# EasyEDA Pro project split-keyboard.eprj

# Schematic Schematic1
Board Name: Left; Create Date: 2025-08-14; Page Name: P1; Project Name: split-keyboard; Schematic Name: Schematic1; Update Date: 2025-09-05; Company: EasyEDA.com; Page Size: A4; Version: V1.0
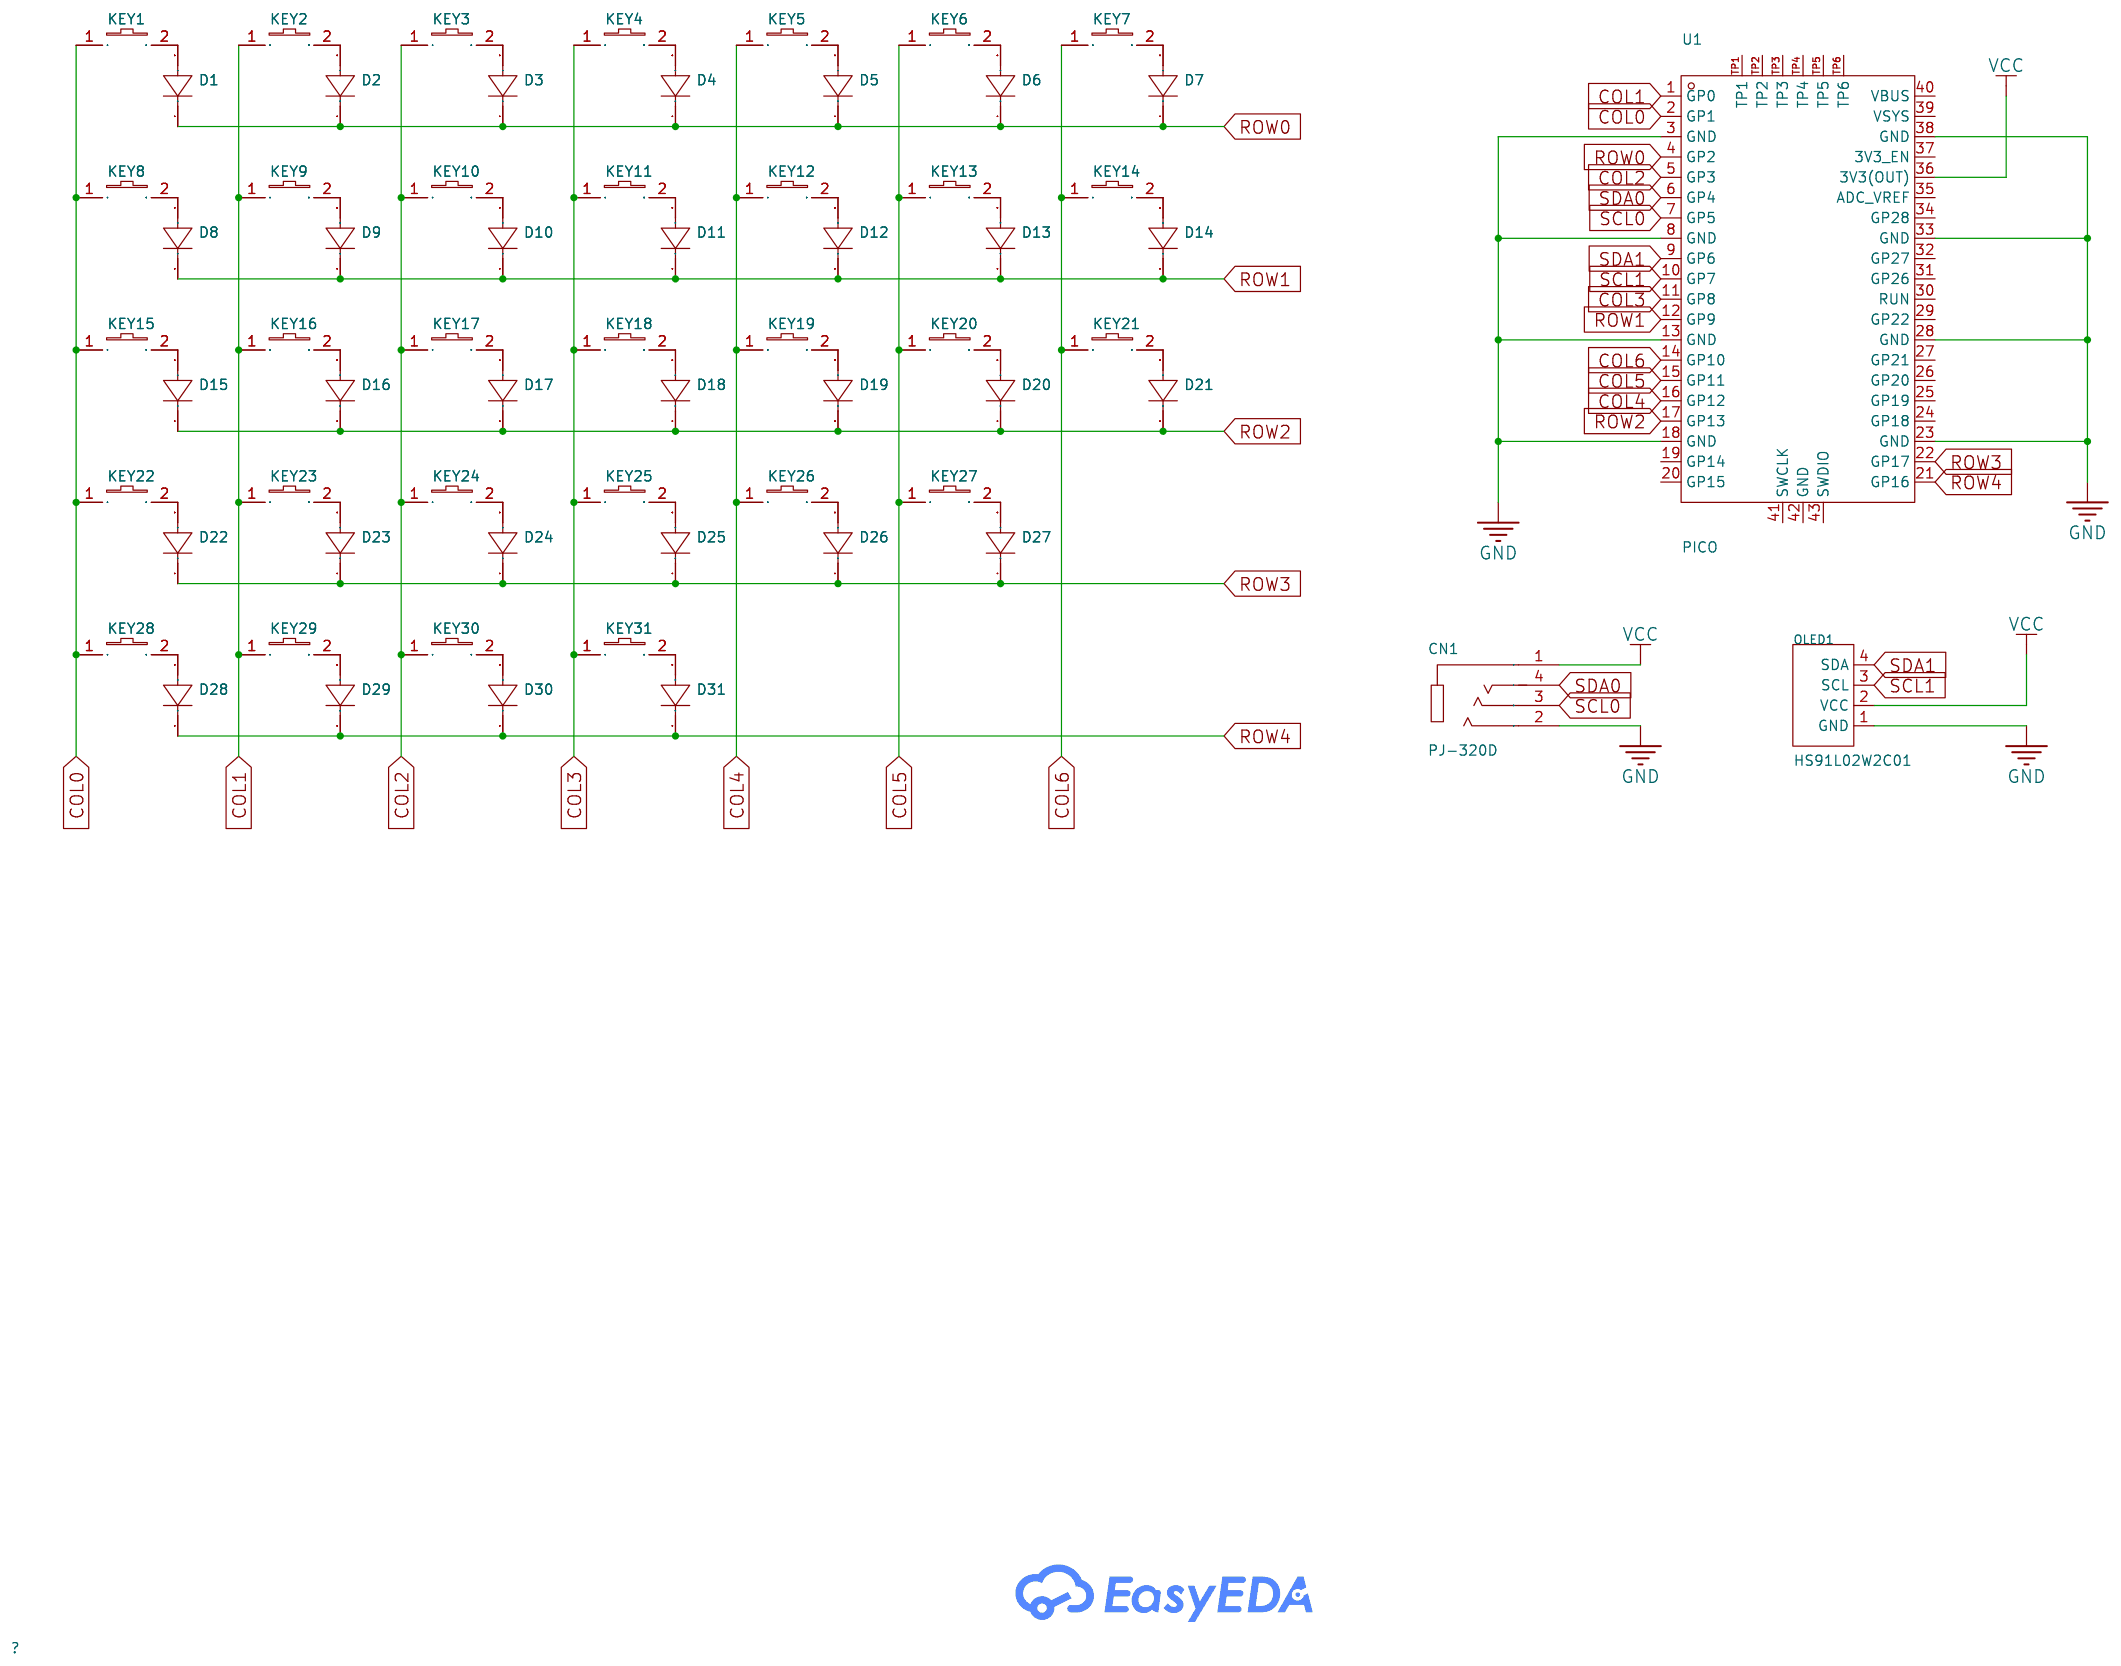
[diagram p0: schematic sheet]

## Parts
CN1  PJ-320D  [AUDIO-SMD_PJ-320D-1]
D1  -  [DO-41_BD2.4-L4.7-P8.70-D0.9-RD]
D2  -  [DO-41_BD2.4-L4.7-P8.70-D0.9-RD]
D3  -  [DO-41_BD2.4-L4.7-P8.70-D0.9-RD]
D4  -  [DO-41_BD2.4-L4.7-P8.70-D0.9-RD]
D5  -  [DO-41_BD2.4-L4.7-P8.70-D0.9-RD]
D6  -  [DO-41_BD2.4-L4.7-P8.70-D0.9-RD]
D7  -  [DO-41_BD2.4-L4.7-P8.70-D0.9-RD]
D8  -  [DO-41_BD2.4-L4.7-P8.70-D0.9-RD]
D9  -  [DO-41_BD2.4-L4.7-P8.70-D0.9-RD]
D10  -  [DO-41_BD2.4-L4.7-P8.70-D0.9-RD]
D11  -  [DO-41_BD2.4-L4.7-P8.70-D0.9-RD]
D12  -  [DO-41_BD2.4-L4.7-P8.70-D0.9-RD]
D13  -  [DO-41_BD2.4-L4.7-P8.70-D0.9-RD]
D14  -  [DO-41_BD2.4-L4.7-P8.70-D0.9-RD]
D15  -  [DO-41_BD2.4-L4.7-P8.70-D0.9-RD]
D16  -  [DO-41_BD2.4-L4.7-P8.70-D0.9-RD]
D17  -  [DO-41_BD2.4-L4.7-P8.70-D0.9-RD]
D18  -  [DO-41_BD2.4-L4.7-P8.70-D0.9-RD]
D19  -  [DO-41_BD2.4-L4.7-P8.70-D0.9-RD]
D20  -  [DO-41_BD2.4-L4.7-P8.70-D0.9-RD]
D21  -  [DO-41_BD2.4-L4.7-P8.70-D0.9-RD]
D22  -  [DO-41_BD2.4-L4.7-P8.70-D0.9-RD]
D23  -  [DO-41_BD2.4-L4.7-P8.70-D0.9-RD]
D24  -  [DO-41_BD2.4-L4.7-P8.70-D0.9-RD]
D25  -  [DO-41_BD2.4-L4.7-P8.70-D0.9-RD]
D26  -  [DO-41_BD2.4-L4.7-P8.70-D0.9-RD]
D27  -  [DO-41_BD2.4-L4.7-P8.70-D0.9-RD]
D28  -  [DO-41_BD2.4-L4.7-P8.70-D0.9-RD]
D29  -  [DO-41_BD2.4-L4.7-P8.70-D0.9-RD]
D30  -  [DO-41_BD2.4-L4.7-P8.70-D0.9-RD]
D31  -  [DO-41_BD2.4-L4.7-P8.70-D0.9-RD]
KEY1  28115182DM  [MX_PCB_1.00u]
KEY2  28115182DM  [MX_PCB_1.00u]
KEY3  28115182DM  [MX_PCB_1.00u]
KEY4  28115182DM  [MX_PCB_1.00u]
KEY5  28115182DM  [MX_PCB_1.00u]
KEY6  28115182DM  [MX_PCB_1.00u]
KEY7  28115182DM  [MX_PCB_1.00u]
KEY8  28115182DM  [MX_PCB_1.00u]
KEY9  28115182DM  [MX_PCB_1.00u]
KEY10  28115182DM  [MX_PCB_1.00u]
KEY11  28115182DM  [MX_PCB_1.00u]
KEY12  28115182DM  [MX_PCB_1.00u]
KEY13  28115182DM  [MX_PCB_1.00u]
KEY14  28115182DM  [MX_PCB_1.00u]
KEY15  28115182DM  [MX_PCB_1.00u]
KEY16  28115182DM  [MX_PCB_1.00u]
KEY17  28115182DM  [MX_PCB_1.00u]
KEY18  28115182DM  [MX_PCB_1.00u]
KEY19  28115182DM  [MX_PCB_1.00u]
KEY20  28115182DM  [MX_PCB_1.00u]
KEY21  28115182DM  [MX_PCB_1.00u]
KEY22  28115182DM  [MX_PCB_1.00u]
KEY23  28115182DM  [MX_PCB_1.00u]
KEY24  28115182DM  [MX_PCB_1.00u]
KEY25  28115182DM  [MX_PCB_1.00u]
KEY26  28115182DM  [MX_PCB_1.00u]
KEY27  28115182DM  [MX_PCB_1.00u]
KEY28  28115182DM  [MX_PCB_1.00u]
KEY29  28115182DM  [MX_PCB_1.00u]
KEY30  28115182DM  [MX_PCB_1.00u]
KEY31  28115182DM  [MX_PCB_1.00u]
OLED1  HS91L02W2C01  [OLED-TH_L38.0-W12.0_HS91L02W2C01]
U1  PICO  [Raspberry_Pi_Pico]

## Library data of the parts
CN1 = PJ-320D_C431535: Connector Type:3.5mm Headphone Jack Current Rating (Max):500mA Voltage Rating (Max):50V Contact Material:Copper Contact Plating:Silver Operating Temperature Range:-30℃~+70℃ Operating Temperature Range:-30℃~+70℃; LCSC Part Name: 3.5mm耳机座; Supplier Part: C431535; Manufacturer: SHOU HAN(首韩); Supplier Footprint: SMD; Datasheet: https://atta.szlcsc.com/upload/public/pdf/source/20190925/C431535_8B274506621F6117FB020BF07A197848.pdf; Supplier: LCSC; Connector Type: 3.5mm Headphone Jack; Current Rating (Max): 500mA; Voltage Rating (Max): 50V; Contact Material: Copper; Contact Plating: Silver; Operating Temperature Range: -30℃~+70℃
D1-D31 = 1N4007: Supplier Footprint: DO-41
KEY1-KEY31 = 28115182DM: Axis Type:水晶轴 Number of Pins:2 Life:5000万次 Operation Force:60gf Conduction Travel:- Voltage Rating:- Operating Temperature:-10℃~+70℃ Operating Temperature:-10℃~+70℃; Supplier Part: C47121945; Manufacturer: SAMZO(三佐); Supplier Footprint: 插件; JLCPCB Part Class: Extended Part; Datasheet: https://atta.szlcsc.com/upload/public/pdf/source/20250402/8399631E7C857A557AEE3DBE24222DC8.pdf; Supplier: LCSC; Axis Type: 水晶轴; Number of Pins: 2; Life: 5000万次; Operation Force: 60gf; Operating Temperature: -10℃~+70℃
OLED1 = HS91L02W2C01: LCSC Part Name: 0.91寸OLED显示屏白光IIC; Supplier Part: C5248081; Manufacturer: HS(汉昇); JLCPCB Part Class: Extended Part; Datasheet: https://atta.szlcsc.com/upload/public/pdf/source/20230727/C3E43C8E3DDA847F5681FEE7D95C153D.pdf; Supplier: LCSC; Main Control Chip: SSD1306; Interface Type: I2C; Size: 0.91; Pixel Resolution: 128x32; Operating Temperature: -40℃~+70℃
U1 = PICO: Supplier Part: C7203002; Manufacturer: Raspberry Pi(树莓派); Datasheet: https://atta.szlcsc.com/upload/public/pdf/source/20230906/086376002DDC9866828648BC93E51F8B.pdf; Supplier: LCSC

## Nets
GND: CN1.2 OLED1.1(GND) U1.3(GND) U1.8(GND) U1.13(GND) U1.18(GND) U1.23(GND) U1.28(GND) U1.33(GND) U1.38(GND)
VCC: CN1.1 OLED1.2(VCC) U1.36(3V3(OUT))
COL0: KEY1.1 KEY8.1 KEY15.1 KEY22.1 KEY28.1 U1.2(GP1)
COL1: KEY2.1 KEY9.1 KEY16.1 KEY23.1 KEY29.1 U1.1(GP0)
COL2: KEY3.1 KEY10.1 KEY17.1 KEY24.1 KEY30.1 U1.5(GP3)
COL3: KEY4.1 KEY11.1 KEY18.1 KEY25.1 KEY31.1 U1.11(GP8)
COL4: KEY5.1 KEY12.1 KEY19.1 KEY26.1 U1.16(GP12)
COL5: KEY6.1 KEY13.1 KEY20.1 KEY27.1 U1.15(GP11)
COL6: KEY7.1 KEY14.1 KEY21.1 U1.14(GP10)
ROW0: D1.1(K) D2.1(K) D3.1(K) D4.1(K) D5.1(K) D6.1(K) D7.1(K) U1.4(GP2)
ROW1: D8.1(K) D9.1(K) D10.1(K) D11.1(K) D12.1(K) D13.1(K) D14.1(K) U1.12(GP9)
ROW2: D15.1(K) D16.1(K) D17.1(K) D18.1(K) D19.1(K) D20.1(K) D21.1(K) U1.17(GP13)
ROW3: D22.1(K) D23.1(K) D24.1(K) D25.1(K) D26.1(K) D27.1(K) U1.22(GP17)
ROW4: D28.1(K) D29.1(K) D30.1(K) D31.1(K) U1.21(GP16)
SCL0: CN1.3 U1.7(GP5)
SCL1: OLED1.3(SCL) U1.10(GP7)
SDA0: CN1.4 U1.6(GP4)
SDA1: OLED1.4(SDA) U1.9(GP6)
$1N158: D1.2(A) KEY1.2
$1N243: D2.2(A) KEY2.2
$1N305: D3.2(A) KEY3.2
$1N549: D4.2(A) KEY4.2
$1N551: D5.2(A) KEY5.2
$1N553: D6.2(A) KEY6.2
$1N987: D7.2(A) KEY7.2
$1N1409: D8.2(A) KEY8.2
$1N1411: D9.2(A) KEY9.2
$1N1413: D10.2(A) KEY10.2
$1N1415: D11.2(A) KEY11.2
$1N1417: D12.2(A) KEY12.2
$1N1419: D13.2(A) KEY13.2
$1N1421: D14.2(A) KEY14.2
$1N1843: D15.2(A) KEY15.2
$1N1845: D16.2(A) KEY16.2
$1N1847: D17.2(A) KEY17.2
$1N1849: D18.2(A) KEY18.2
$1N1851: D19.2(A) KEY19.2
$1N1853: D20.2(A) KEY20.2
$1N1855: D21.2(A) KEY21.2
$1N2217: D22.2(A) KEY22.2
$1N2219: D23.2(A) KEY23.2
$1N2221: D24.2(A) KEY24.2
$1N2223: D25.2(A) KEY25.2
$1N2225: D26.2(A) KEY26.2
$1N2227: D27.2(A) KEY27.2
$1N2529: D28.2(A) KEY28.2
$1N2531: D29.2(A) KEY29.2
$1N4626: D30.2(A) KEY30.2
$1N4628: D31.2(A) KEY31.2

Not connected (* = marked no-connect by the designer): U1 19(GP14) 20(GP15) 24(GP18) 25(GP19) 26(GP20) 27(GP21) 29(GP22) 30(RUN) 31(GP26) 32(GP27) 34(GP28) 35(ADC_VREF) 37(3V3_EN) 39(VSYS) 40(VBUS) 41(SWCLK) 42(GND) 43(SWDIO) TP1 TP2 TP3 TP4 TP5 TP6

# Schematic Schematic2
Board Name: Right; Create Date: 2025-09-15; Page Name: P1; Project Name: split-keyboard; Schematic Name: Schematic2; Update Date: 2025-09-16; Company: EasyEDA.com; Page Size: A4; Version: V1.0
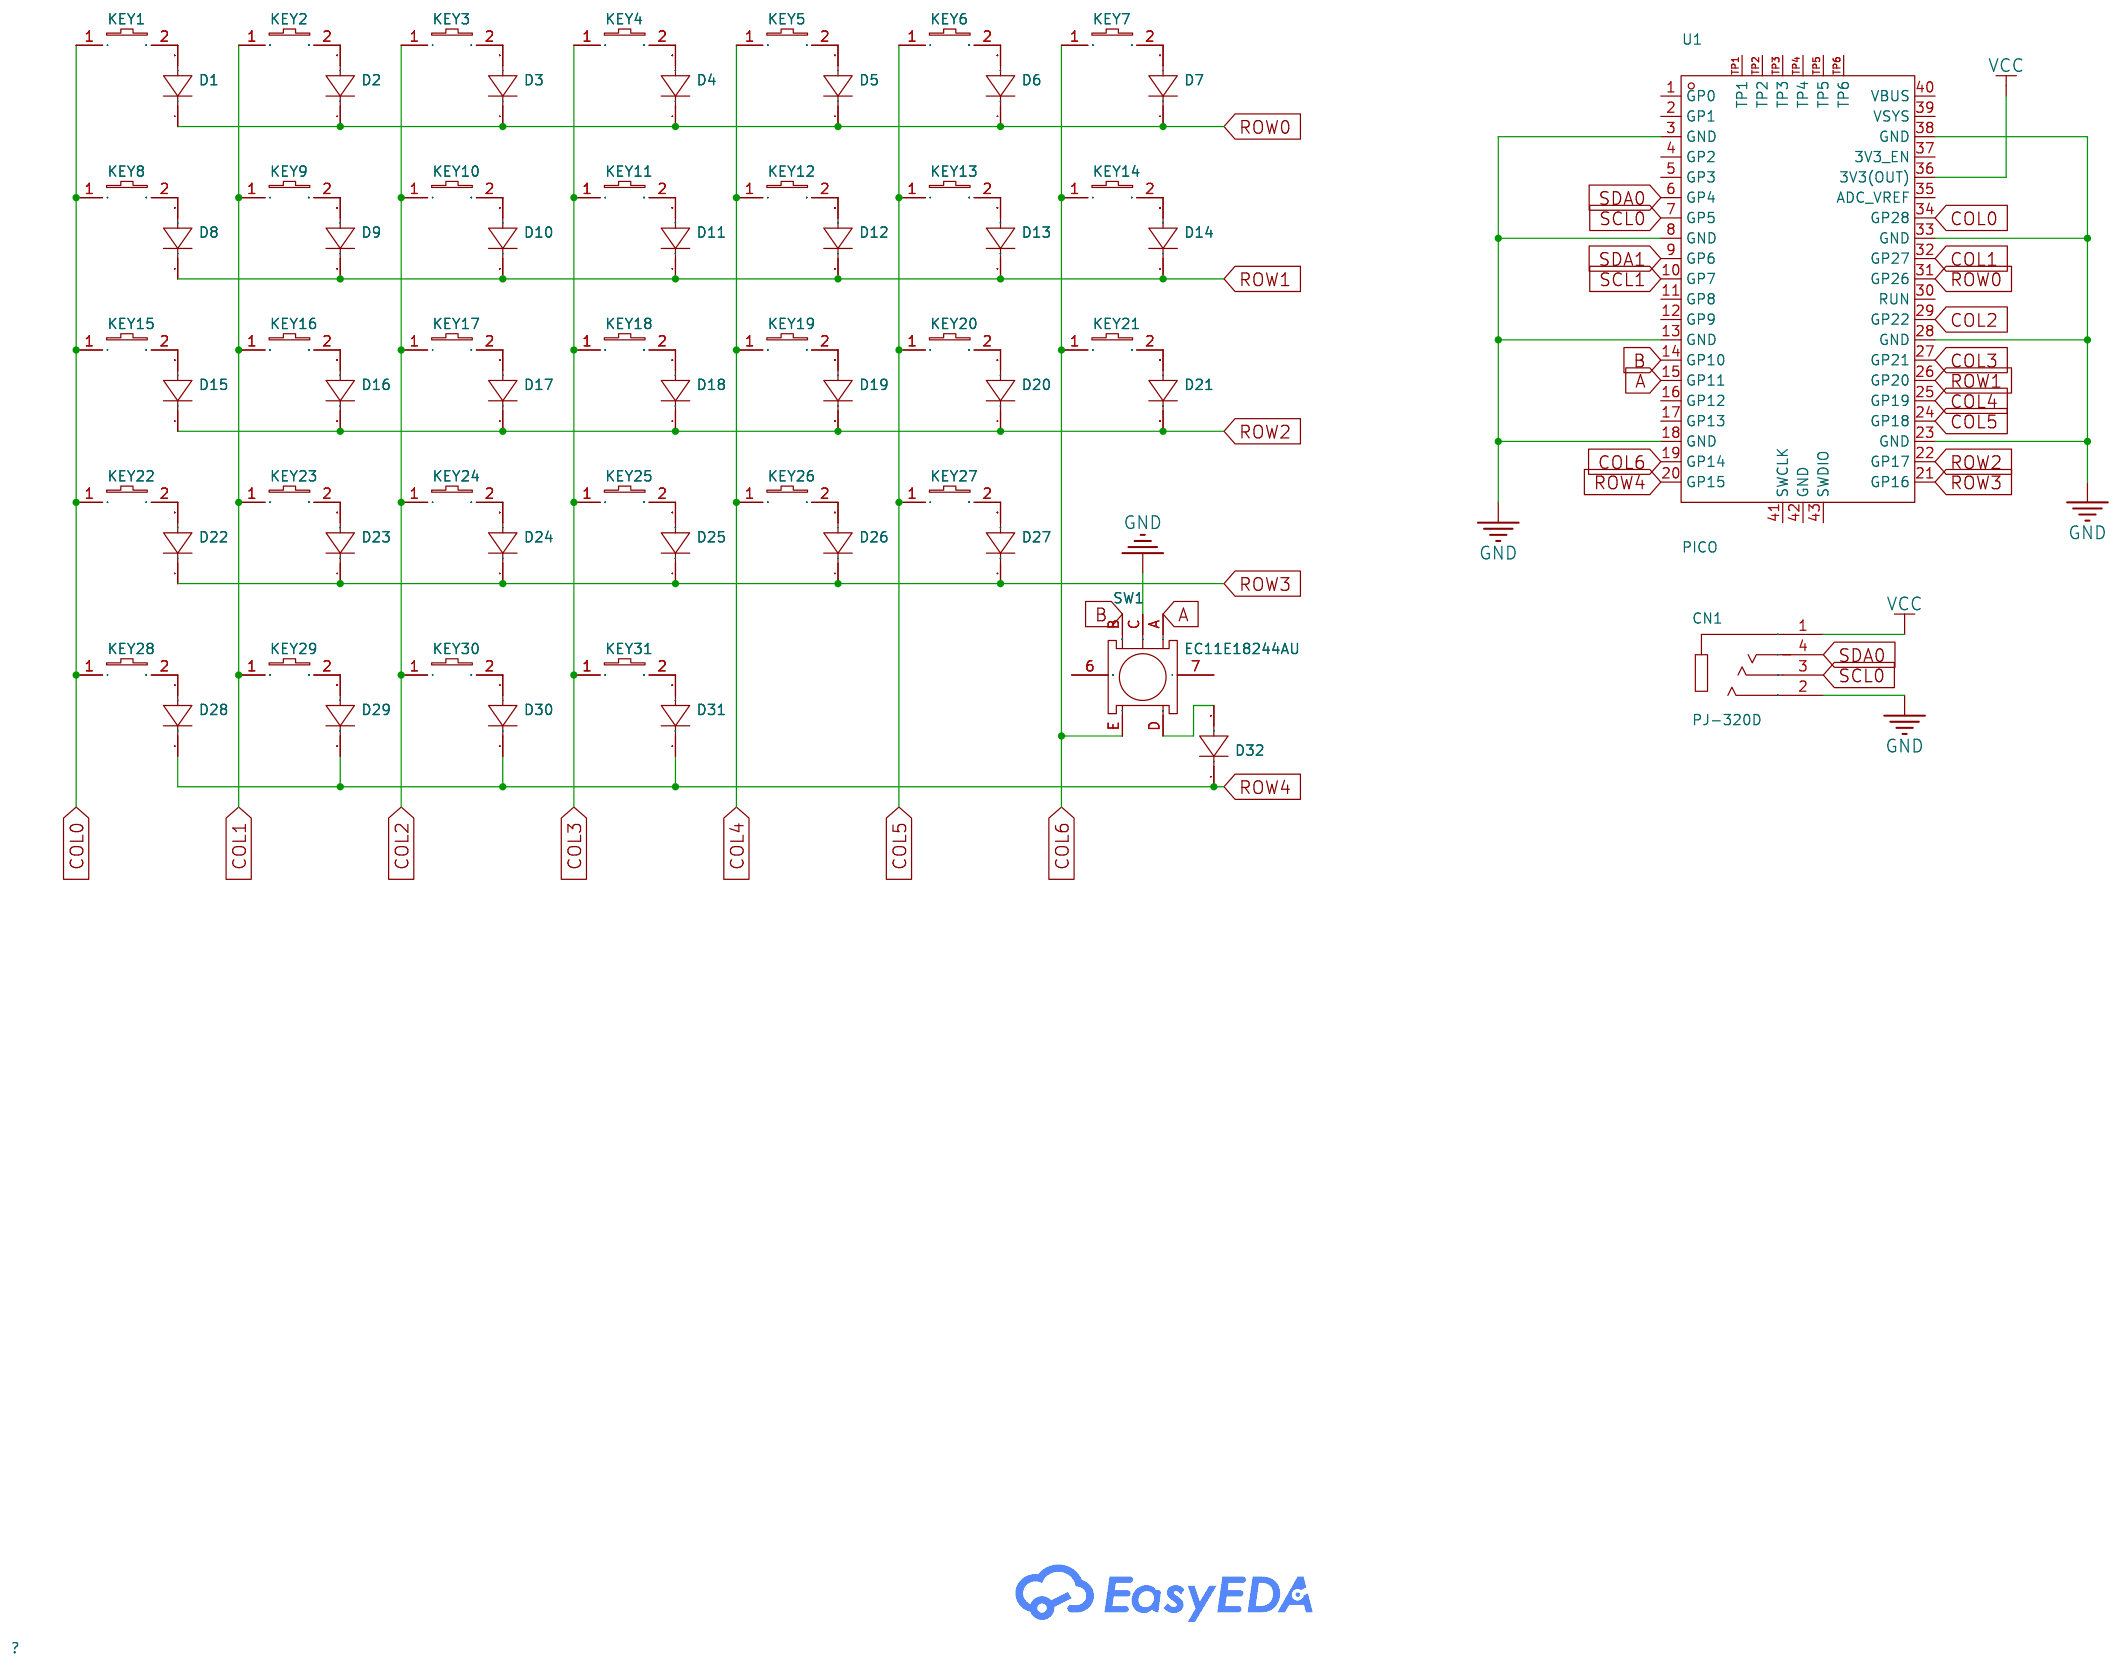
[diagram p1: schematic sheet]

## Parts
CN1  PJ-320D  [AUDIO-SMD_PJ-320D-1]
D1  -  [DO-41_BD2.4-L4.7-P8.70-D0.9-RD]
D2  -  [DO-41_BD2.4-L4.7-P8.70-D0.9-RD]
D3  -  [DO-41_BD2.4-L4.7-P8.70-D0.9-RD]
D4  -  [DO-41_BD2.4-L4.7-P8.70-D0.9-RD]
D5  -  [DO-41_BD2.4-L4.7-P8.70-D0.9-RD]
D6  -  [DO-41_BD2.4-L4.7-P8.70-D0.9-RD]
D7  -  [DO-41_BD2.4-L4.7-P8.70-D0.9-RD]
D8  -  [DO-41_BD2.4-L4.7-P8.70-D0.9-RD]
D9  -  [DO-41_BD2.4-L4.7-P8.70-D0.9-RD]
D10  -  [DO-41_BD2.4-L4.7-P8.70-D0.9-RD]
D11  -  [DO-41_BD2.4-L4.7-P8.70-D0.9-RD]
D12  -  [DO-41_BD2.4-L4.7-P8.70-D0.9-RD]
D13  -  [DO-41_BD2.4-L4.7-P8.70-D0.9-RD]
D14  -  [DO-41_BD2.4-L4.7-P8.70-D0.9-RD]
D15  -  [DO-41_BD2.4-L4.7-P8.70-D0.9-RD]
D16  -  [DO-41_BD2.4-L4.7-P8.70-D0.9-RD]
D17  -  [DO-41_BD2.4-L4.7-P8.70-D0.9-RD]
D18  -  [DO-41_BD2.4-L4.7-P8.70-D0.9-RD]
D19  -  [DO-41_BD2.4-L4.7-P8.70-D0.9-RD]
D20  -  [DO-41_BD2.4-L4.7-P8.70-D0.9-RD]
D21  -  [DO-41_BD2.4-L4.7-P8.70-D0.9-RD]
D22  -  [DO-41_BD2.4-L4.7-P8.70-D0.9-RD]
D23  -  [DO-41_BD2.4-L4.7-P8.70-D0.9-RD]
D24  -  [DO-41_BD2.4-L4.7-P8.70-D0.9-RD]
D25  -  [DO-41_BD2.4-L4.7-P8.70-D0.9-RD]
D26  -  [DO-41_BD2.4-L4.7-P8.70-D0.9-RD]
D27  -  [DO-41_BD2.4-L4.7-P8.70-D0.9-RD]
D28  -  [DO-41_BD2.4-L4.7-P8.70-D0.9-RD]
D29  -  [DO-41_BD2.4-L4.7-P8.70-D0.9-RD]
D30  -  [DO-41_BD2.4-L4.7-P8.70-D0.9-RD]
D31  -  [DO-41_BD2.4-L4.7-P8.70-D0.9-RD]
D32  -  [DO-41_BD2.4-L4.7-P8.70-D0.9-RD]
KEY1  28115182DM  [MX_PCB_1.00u]
KEY2  28115182DM  [MX_PCB_1.00u]
KEY3  28115182DM  [MX_PCB_1.00u]
KEY4  28115182DM  [MX_PCB_1.00u]
KEY5  28115182DM  [MX_PCB_1.00u]
KEY6  28115182DM  [MX_PCB_1.00u]
KEY7  28115182DM  [MX_PCB_1.00u]
KEY8  28115182DM  [MX_PCB_1.00u]
KEY9  28115182DM  [MX_PCB_1.00u]
KEY10  28115182DM  [MX_PCB_1.00u]
KEY11  28115182DM  [MX_PCB_1.00u]
KEY12  28115182DM  [MX_PCB_1.00u]
KEY13  28115182DM  [MX_PCB_1.00u]
KEY14  28115182DM  [MX_PCB_1.00u]
KEY15  28115182DM  [MX_PCB_1.00u]
KEY16  28115182DM  [MX_PCB_1.00u]
KEY17  28115182DM  [MX_PCB_1.00u]
KEY18  28115182DM  [MX_PCB_1.00u]
KEY19  28115182DM  [MX_PCB_1.00u]
KEY20  28115182DM  [MX_PCB_1.00u]
KEY21  28115182DM  [MX_PCB_1.00u]
KEY22  28115182DM  [MX_PCB_1.00u]
KEY23  28115182DM  [MX_PCB_1.00u]
KEY24  28115182DM  [MX_PCB_1.00u]
KEY25  28115182DM  [MX_PCB_1.00u]
KEY26  28115182DM  [MX_PCB_1.00u]
KEY27  28115182DM  [MX_PCB_1.00u]
KEY28  28115182DM  [MX_PCB_1.00u]
KEY29  28115182DM  [MX_PCB_1.00u]
KEY30  28115182DM  [MX_PCB_1.00u]
KEY31  28115182DM  [MX_PCB_1.00u]
SW1  EC11E18244AU  [SW-TH_EC11XXXXXXXX]
U1  PICO  [Raspberry_Pi_Pico]

## Library data of the parts
CN1 = PJ-320D_C431535: Connector Type:3.5mm Headphone Jack Current Rating (Max):500mA Voltage Rating (Max):50V Contact Material:Copper Contact Plating:Silver Operating Temperature Range:-30℃~+70℃ Operating Temperature Range:-30℃~+70℃; LCSC Part Name: 3.5mm耳机座; Supplier Part: C431535; Manufacturer: SHOU HAN(首韩); Supplier Footprint: SMD; Datasheet: https://atta.szlcsc.com/upload/public/pdf/source/20190925/C431535_8B274506621F6117FB020BF07A197848.pdf; Supplier: LCSC; Connector Type: 3.5mm Headphone Jack; Current Rating (Max): 500mA; Voltage Rating (Max): 50V; Contact Material: Copper; Contact Plating: Silver; Operating Temperature Range: -30℃~+70℃
D1-D32 = 1N4007: Supplier Footprint: DO-41
KEY1-KEY31 = 28115182DM: Axis Type:水晶轴 Number of Pins:2 Life:5000万次 Operation Force:60gf Conduction Travel:- Voltage Rating:- Operating Temperature:-10℃~+70℃ Operating Temperature:-10℃~+70℃; Supplier Part: C47121945; Manufacturer: SAMZO(三佐); Supplier Footprint: 插件; JLCPCB Part Class: Extended Part; Datasheet: https://atta.szlcsc.com/upload/public/pdf/source/20250402/8399631E7C857A557AEE3DBE24222DC8.pdf; Supplier: LCSC; Axis Type: 水晶轴; Number of Pins: 2; Life: 5000万次; Operation Force: 60gf; Operating Temperature: -10℃~+70℃
SW1 = EC11E18244AU: Supplier Part: C202365; Manufacturer: ALPSALPINE(阿尔卑斯阿尔派); Supplier Footprint: 插件; Datasheet: https://atta.szlcsc.com/upload/public/pdf/source/20180403/C202365_70FA927E879F562641EADC151E1E414A.pdf; Supplier: LCSC
U1 = PICO: Supplier Part: C7203002; Manufacturer: Raspberry Pi(树莓派); Datasheet: https://atta.szlcsc.com/upload/public/pdf/source/20230906/086376002DDC9866828648BC93E51F8B.pdf; Supplier: LCSC

## Nets
GND: CN1.2 SW1.C U1.3(GND) U1.8(GND) U1.13(GND) U1.18(GND) U1.23(GND) U1.28(GND) U1.33(GND) U1.38(GND)
VCC: CN1.1 U1.36(3V3(OUT))
A: SW1.A U1.15(GP11)
B: SW1.B U1.14(GP10)
COL0: KEY1.1 KEY8.1 KEY15.1 KEY22.1 KEY28.1 U1.34(GP28)
COL1: KEY2.1 KEY9.1 KEY16.1 KEY23.1 KEY29.1 U1.32(GP27)
COL2: KEY3.1 KEY10.1 KEY17.1 KEY24.1 KEY30.1 U1.29(GP22)
COL3: KEY4.1 KEY11.1 KEY18.1 KEY25.1 KEY31.1 U1.27(GP21)
COL4: KEY5.1 KEY12.1 KEY19.1 KEY26.1 U1.25(GP19)
COL5: KEY6.1 KEY13.1 KEY20.1 KEY27.1 U1.24(GP18)
COL6: KEY7.1 KEY14.1 KEY21.1 SW1.E U1.19(GP14)
ROW0: D1.1(K) D2.1(K) D3.1(K) D4.1(K) D5.1(K) D6.1(K) D7.1(K) U1.31(GP26)
ROW1: D8.1(K) D9.1(K) D10.1(K) D11.1(K) D12.1(K) D13.1(K) D14.1(K) U1.26(GP20)
ROW2: D15.1(K) D16.1(K) D17.1(K) D18.1(K) D19.1(K) D20.1(K) D21.1(K) U1.22(GP17)
ROW3: D22.1(K) D23.1(K) D24.1(K) D25.1(K) D26.1(K) D27.1(K) U1.21(GP16)
ROW4: D28.1(K) D29.1(K) D30.1(K) D31.1(K) D32.1(K) U1.20(GP15)
SCL0: CN1.3 U1.7(GP5)
SCL1: U1.10(GP7)
SDA0: CN1.4 U1.6(GP4)
SDA1: U1.9(GP6)
$1N158: D1.2(A) KEY1.2
$1N243: D2.2(A) KEY2.2
$1N305: D3.2(A) KEY3.2
$1N549: D4.2(A) KEY4.2
$1N551: D5.2(A) KEY5.2
$1N553: D6.2(A) KEY6.2
$1N987: D7.2(A) KEY7.2
$1N1409: D8.2(A) KEY8.2
$1N1411: D9.2(A) KEY9.2
$1N1413: D10.2(A) KEY10.2
$1N1415: D11.2(A) KEY11.2
$1N1417: D12.2(A) KEY12.2
$1N1419: D13.2(A) KEY13.2
$1N1421: D14.2(A) KEY14.2
$1N1843: D15.2(A) KEY15.2
$1N1845: D16.2(A) KEY16.2
$1N1847: D17.2(A) KEY17.2
$1N1849: D18.2(A) KEY18.2
$1N1851: D19.2(A) KEY19.2
$1N1853: D20.2(A) KEY20.2
$1N1855: D21.2(A) KEY21.2
$1N2217: D22.2(A) KEY22.2
$1N2219: D23.2(A) KEY23.2
$1N2221: D24.2(A) KEY24.2
$1N2223: D25.2(A) KEY25.2
$1N2225: D26.2(A) KEY26.2
$1N2227: D27.2(A) KEY27.2
$1N2529: D28.2(A) KEY28.2
$1N2531: D29.2(A) KEY29.2
$1N4626: D30.2(A) KEY30.2
$1N4628: D31.2(A) KEY31.2
$1N26639: D32.2(A) SW1.D

Not connected (* = marked no-connect by the designer): SW1 6 7; U1 1(GP0) 2(GP1) 4(GP2) 5(GP3) 11(GP8) 12(GP9) 16(GP12) 17(GP13) 30(RUN) 35(ADC_VREF) 37(3V3_EN) 39(VSYS) 40(VBUS) 41(SWCLK) 42(GND) 43(SWDIO) TP1 TP2 TP3 TP4 TP5 TP6

# Board PCB2
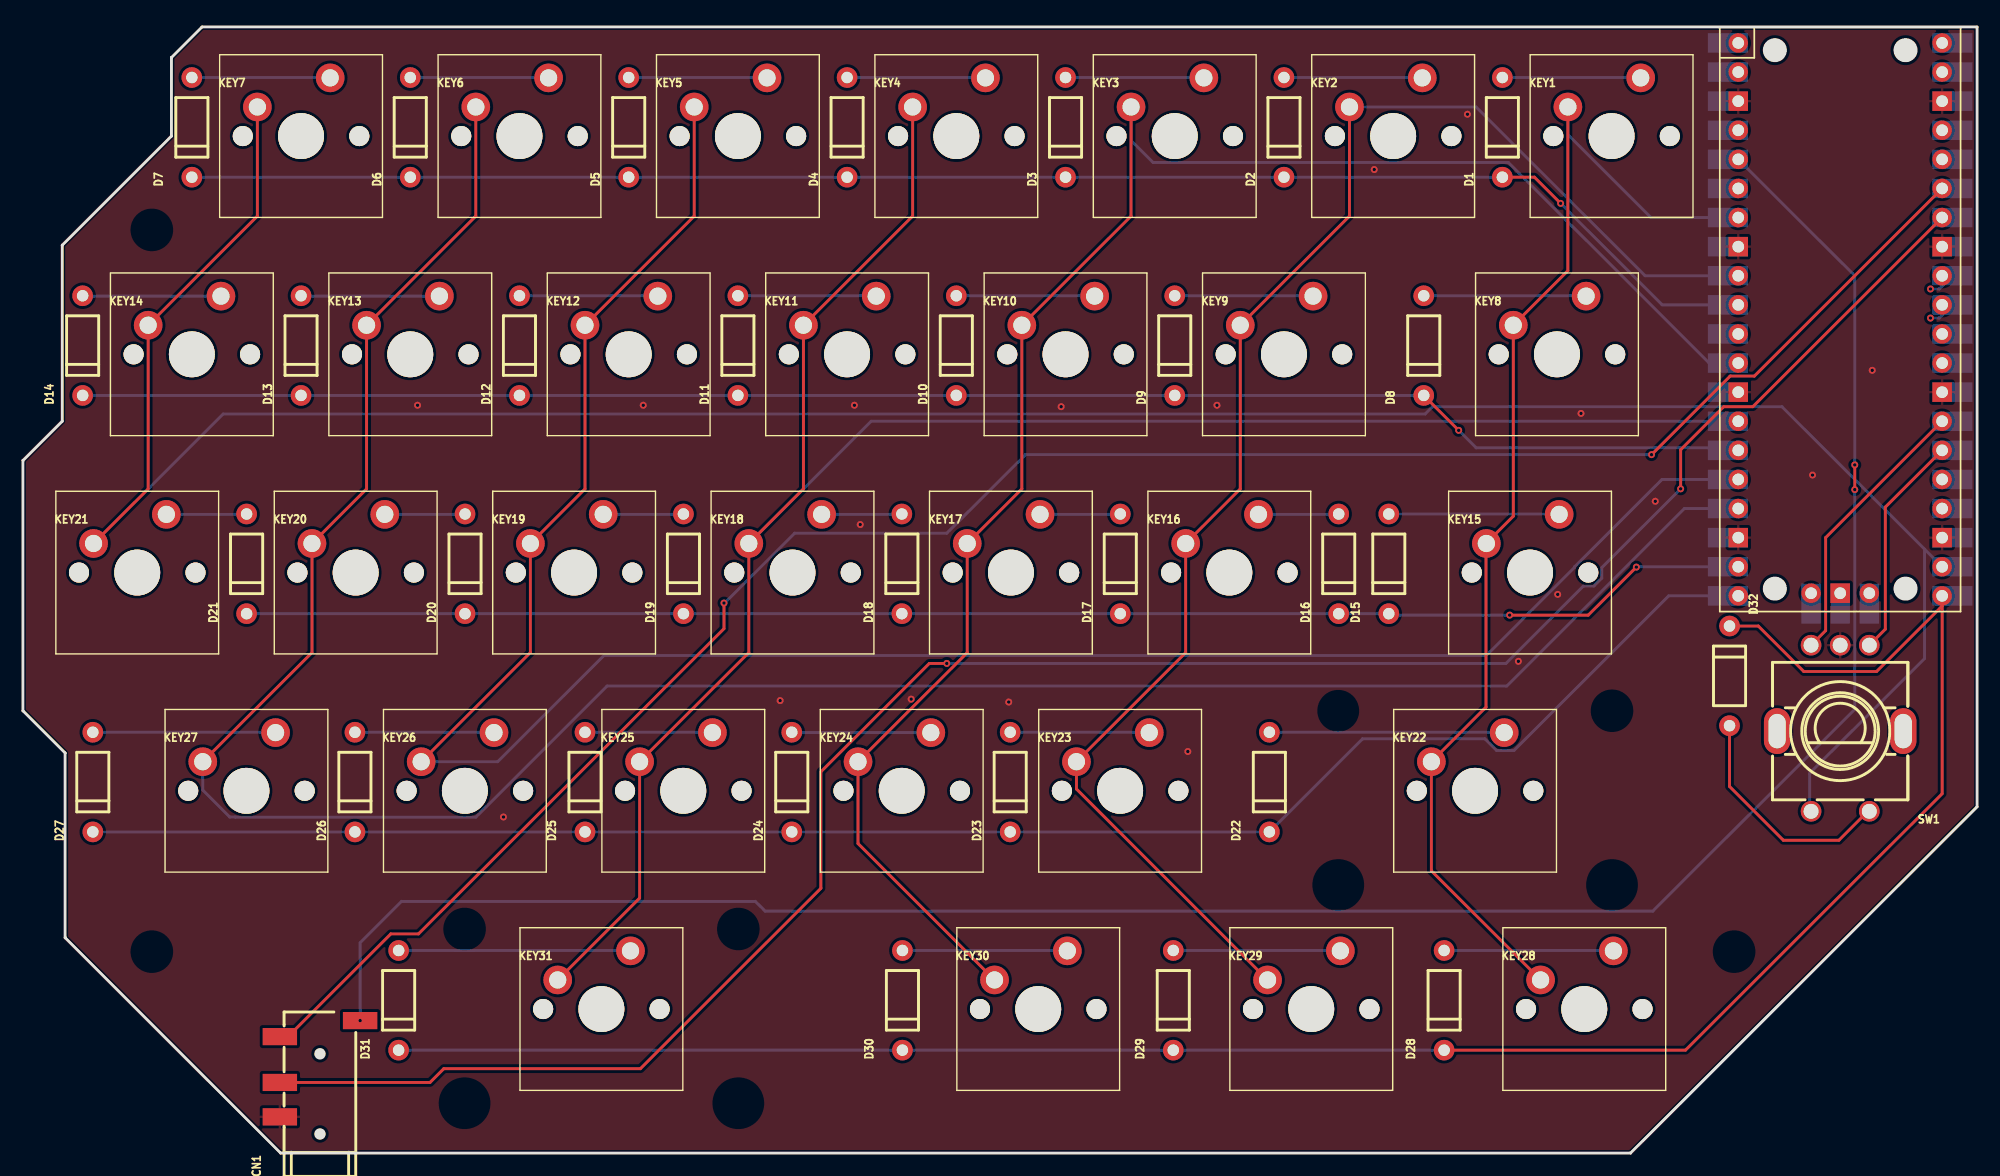
[diagram p2: board, top side]
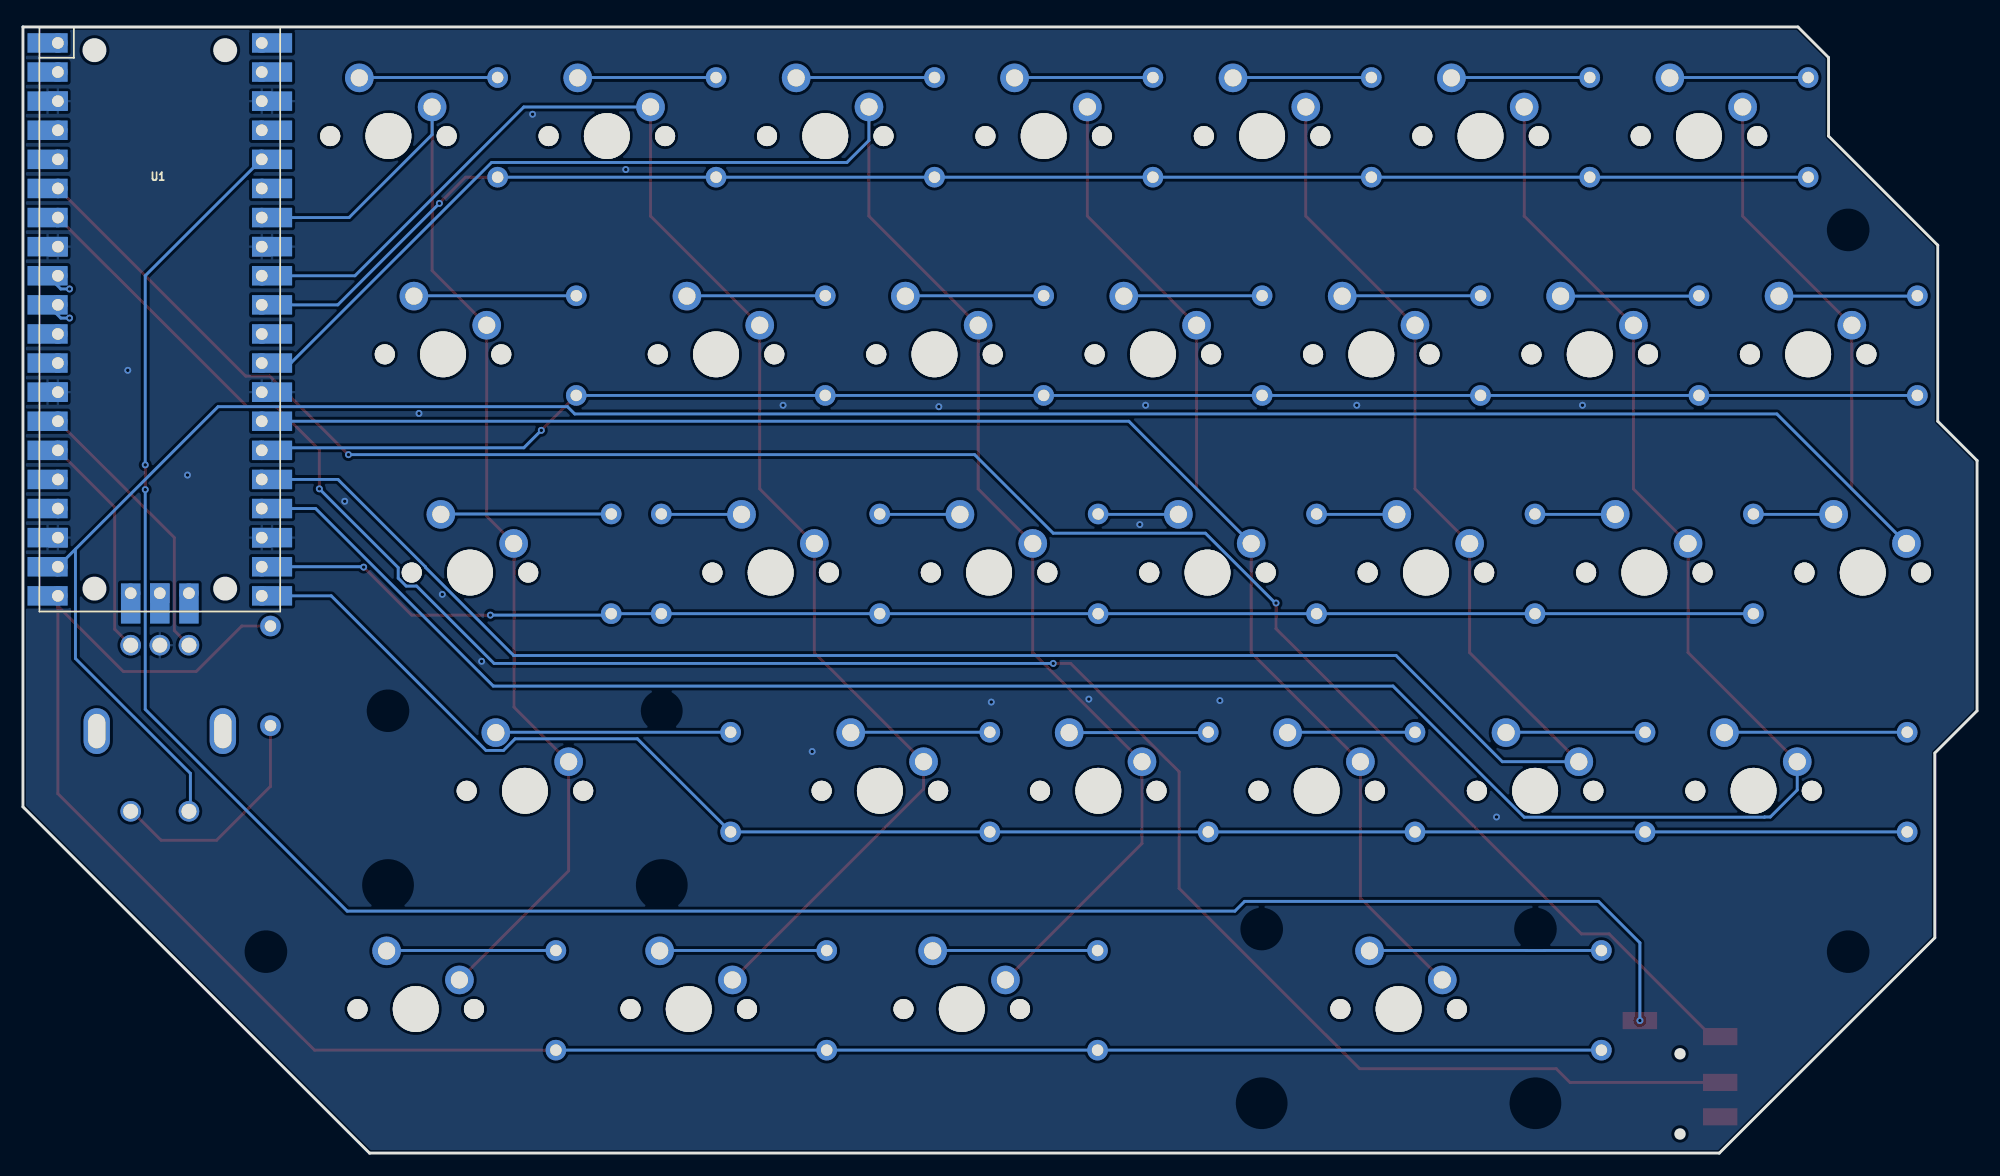
[diagram p3: board, bottom side, seen from below]

Outline 170.43 x 98.3 mm; copper layers: Top Layer, Bottom Layer. Coordinates in mm from the lower left corner of the outline.
Outline path: 0,60.45 0,38.61 3.68,34.92 3.68,18.8 22.48,0 140.21,0 170.43,30.23 170.43,98.3 15.62,98.3 12.95,95.63 12.95,88.77 3.43,79.25 3.43,63.88 0,60.45
Stack: Top Layer 0.035mm / Dielectric1 1.51mm FR4 er 4.5 / Bottom Layer 0.035mm

## Design rules (mm)
template: JLCPCB Capability(Two Layers Board)
spacing copperThickness1oz (default): track to track 0.102, other pairs 0.152 to 0.3
spacing copperThickness2oz: track to track 0.203, other pairs 0.152 to 0.3
track width copperThickness1oz (default): min 0.127, default 0.254, max 2.54
track width copperThickness2oz: min 0.203, default 0.254, max 2.54
differential pair differentialPair (default): width min 0.127, default 0.254, max 2.54; gap min 0.152, default 0.152
via viaSize (default): diameter min 0.5, default 0.61, max 10; hole min 0.3, default 0.305, max 6.3

## Placement (name value [footprint] x y rotation side)
CN1  PJ-320D  [AUDIO-SMD_PJ-320D-1]  25.91 7.37 90 top
D1  -  [DO-41_BD2.4-L4.7-P8.70-D0.9-RD]  129.03 89.53 90 top
D2  -  [DO-41_BD2.4-L4.7-P8.70-D0.9-RD]  109.98 89.53 90 top
D3  -  [DO-41_BD2.4-L4.7-P8.70-D0.9-RD]  90.93 89.53 90 top
D4  -  [DO-41_BD2.4-L4.7-P8.70-D0.9-RD]  71.88 89.53 90 top
D5  -  [DO-41_BD2.4-L4.7-P8.70-D0.9-RD]  52.83 89.53 90 top
D6  -  [DO-41_BD2.4-L4.7-P8.70-D0.9-RD]  33.78 89.53 90 top
D7  -  [DO-41_BD2.4-L4.7-P8.70-D0.9-RD]  14.73 89.53 90 top
D8  -  [DO-41_BD2.4-L4.7-P8.70-D0.9-RD]  122.17 70.48 90 top
D9  -  [DO-41_BD2.4-L4.7-P8.70-D0.9-RD]  100.46 70.48 90 top
D10  -  [DO-41_BD2.4-L4.7-P8.70-D0.9-RD]  81.41 70.48 90 top
D11  -  [DO-41_BD2.4-L4.7-P8.70-D0.9-RD]  62.36 70.48 90 top
D12  -  [DO-41_BD2.4-L4.7-P8.70-D0.9-RD]  43.31 70.48 90 top
D13  -  [DO-41_BD2.4-L4.7-P8.70-D0.9-RD]  24.26 70.48 90 top
D14  -  [DO-41_BD2.4-L4.7-P8.70-D0.9-RD]  5.21 70.48 90 top
D15  -  [DO-41_BD2.4-L4.7-P8.70-D0.9-RD]  119.13 51.44 90 top
D16  -  [DO-41_BD2.4-L4.7-P8.70-D0.9-RD]  114.76 51.44 90 top
D17  -  [DO-41_BD2.4-L4.7-P8.70-D0.9-RD]  95.71 51.44 90 top
D18  -  [DO-41_BD2.4-L4.7-P8.70-D0.9-RD]  76.66 51.44 90 top
D19  -  [DO-41_BD2.4-L4.7-P8.70-D0.9-RD]  57.61 51.44 90 top
D20  -  [DO-41_BD2.4-L4.7-P8.70-D0.9-RD]  38.56 51.44 90 top
D21  -  [DO-41_BD2.4-L4.7-P8.70-D0.9-RD]  19.51 51.44 90 top
D22  -  [DO-41_BD2.4-L4.7-P8.70-D0.9-RD]  108.71 32.39 90 top
D23  -  [DO-41_BD2.4-L4.7-P8.70-D0.9-RD]  86.11 32.39 90 top
D24  -  [DO-41_BD2.4-L4.7-P8.70-D0.9-RD]  67.06 32.39 90 top
D25  -  [DO-41_BD2.4-L4.7-P8.70-D0.9-RD]  49.02 32.39 90 top
D26  -  [DO-41_BD2.4-L4.7-P8.70-D0.9-RD]  28.96 32.39 90 top
D27  -  [DO-41_BD2.4-L4.7-P8.70-D0.9-RD]  6.1 32.39 90 top
D28  -  [DO-41_BD2.4-L4.7-P8.70-D0.9-RD]  123.95 13.34 90 top
D29  -  [DO-41_BD2.4-L4.7-P8.70-D0.9-RD]  100.33 13.34 90 top
D30  -  [DO-41_BD2.4-L4.7-P8.70-D0.9-RD]  76.71 13.34 90 top
D31  -  [DO-41_BD2.4-L4.7-P8.70-D0.9-RD]  32.77 13.34 90 top
D32  -  [DO-41_BD2.4-L4.7-P8.70-D0.9-RD]  148.84 41.66 270 top
KEY1  28115182DM  [MX_PCB_1.00u]  138.56 88.77 0 top
KEY2  28115182DM  [MX_PCB_1.00u]  119.51 88.77 0 top
KEY3  28115182DM  [MX_PCB_1.00u]  100.46 88.77 0 top
KEY4  28115182DM  [MX_PCB_1.00u]  81.41 88.77 0 top
KEY5  28115182DM  [MX_PCB_1.00u]  62.36 88.77 0 top
KEY6  28115182DM  [MX_PCB_1.00u]  43.31 88.77 0 top
KEY7  28115182DM  [MX_PCB_1.00u]  24.26 88.77 0 top
KEY8  28115182DM  [MX_PCB_1.00u]  133.79 69.72 0 top
KEY9  28115182DM  [MX_PCB_1.00u]  109.98 69.72 0 top
KEY10  28115182DM  [MX_PCB_1.00u]  90.93 69.72 0 top
KEY11  28115182DM  [MX_PCB_1.00u]  71.88 69.72 0 top
KEY12  28115182DM  [MX_PCB_1.00u]  52.83 69.72 0 top
KEY13  28115182DM  [MX_PCB_1.00u]  33.78 69.72 0 top
KEY14  28115182DM  [MX_PCB_1.00u]  14.73 69.72 0 top
KEY15  28115182DM  [MX_PCB_1.00u]  131.44 50.67 0 top
KEY16  28115182DM  [MX_PCB_1.00u]  105.22 50.67 0 top
KEY17  28115182DM  [MX_PCB_1.00u]  86.17 50.67 0 top
KEY18  28115182DM  [MX_PCB_1.00u]  67.12 50.67 0 top
KEY19  28115182DM  [MX_PCB_1.00u]  48.07 50.67 0 top
KEY20  28115182DM  [MX_PCB_1.00u]  29.02 50.67 0 top
KEY21  28115182DM  [MX_PCB_1.00u]  9.97 50.67 0 top
KEY22  28115182DM  [MX_PCB_1.00u]  126.65 31.62 0 top
KEY23  28115182DM  [MX_PCB_1.00u]  95.69 31.62 0 top
KEY24  28115182DM  [MX_PCB_1.00u]  76.64 31.62 0 top
KEY25  28115182DM  [MX_PCB_1.00u]  57.59 31.62 0 top
KEY26  28115182DM  [MX_PCB_1.00u]  38.54 31.62 0 top
KEY27  28115182DM  [MX_PCB_1.00u]  19.49 31.62 0 top
KEY28  28115182DM  [MX_PCB_1.00u]  136.18 12.57 0 top
KEY29  28115182DM  [MX_PCB_1.00u]  112.36 12.57 0 top
KEY30  28115182DM  [MX_PCB_1.00u]  88.55 12.57 0 top
KEY31  28115182DM  [MX_PCB_1.00u]  50.45 12.57 0 top
SW1  EC11E18244AU  [SW-TH_EC11XXXXXXXX]  158.5 37.08 180 top
U1  PICO  [Raspberry_Pi_Pico]  158.5 72.77 180 bottom

## Footprints (pads in the part's own frame, mm; a bottom-side part is the same pattern mirrored in y, then rotated)
AUDIO-SMD_PJ-320D-1
  rect 1.5x3 smd: 1(4.2,-3.5) 2(-4.2,3.5) 3(-1.2,3.5) 4(2.8,3.5)
DO-41_BD2.4-L4.7-P8.70-D0.9-RD
  round 1.8 hole 1: 1(-4.35,0) 2(4.35,0)
MX_PCB_1.00u
  round 1.75 hole 1.75: (-5.08,0) (5.08,0)
  round 4 hole 4: (0,0)
  round 2.5 hole 1.5: 1(-3.81,2.54) 2(2.54,5.08)
Raspberry_Pi_Pico
  rect 3.5x1.7 smd: 1(-9.79,24.13) 2(-9.79,21.59) 3(-9.79,19.05) 4(-9.79,16.51) 5(-9.79,13.97) 6(-9.79,11.43) 7(-9.79,8.89) 8(-9.79,6.35) 9(-9.79,3.81) 10(-9.79,1.27) 11(-9.79,-1.27) 12(-9.79,-3.81) 13(-9.79,-6.35) 14(-9.79,-8.89) 15(-9.79,-11.43) 16(-9.79,-13.97) 17(-9.79,-16.51) 18(-9.79,-19.05) 19(-9.79,-21.59) 20(-9.79,-24.13) 21(9.79,-24.13) 22(9.79,-21.59) 23(9.79,-19.05) 24(9.79,-16.51) 25(9.79,-13.97) 26(9.79,-11.43) 27(9.79,-8.89) 28(9.79,-6.35) 29(9.79,-3.81) 30(9.79,-1.27) 31(9.79,1.27) 32(9.79,3.81) 33(9.79,6.35) 34(9.79,8.89) 35(9.79,11.43) 36(9.79,13.97) 37(9.79,16.51) 38(9.79,19.05) 39(9.79,21.59) 40(9.79,24.13)
  round 1.7 hole 1.02: 1(-8.89,24.13) 2(-8.89,21.59) 4(-8.89,16.51) 5(-8.89,13.97) 6(-8.89,11.43) 7(-8.89,8.89) 9(-8.89,3.81) 10(-8.89,1.27) 11(-8.89,-1.27) 12(-8.89,-3.81) 14(-8.89,-8.89) 15(-8.89,-11.43) 16(-8.89,-13.97) 17(-8.89,-16.51) 19(-8.89,-21.59) 20(-8.89,-24.13) 21(8.89,-24.13) 22(8.89,-21.59) 24(8.89,-16.51) 25(8.89,-13.97) 26(8.89,-11.43) 27(8.89,-8.89) 29(8.89,-3.81) 30(8.89,-1.27) 31(8.89,1.27) 32(8.89,3.81) 34(8.89,8.89) 35(8.89,11.43) 36(8.89,13.97) 37(8.89,16.51) 39(8.89,21.59) 40(8.89,24.13) 41(-2.54,-23.9) 43(2.54,-23.9)
  rect 1.7x1.7 hole 1.02: 3(-8.89,19.05) 8(-8.89,6.35) 13(-8.89,-6.35) 18(-8.89,-19.05) 23(8.89,-19.05) 28(8.89,-6.35) 33(8.89,6.35) 38(8.89,19.05) 42(0,-23.9)
  rect 1.7x3.5 smd: 41(-2.54,-24.8) 42(0,-24.8) 43(2.54,-24.8)
SW-TH_EC11XXXXXXXX
  oval 2.3x4 hole 1.5x3: 6(5.5,0.25) 7(-5.5,0.25)
  round 1.8 hole 1.3: A(-2.54,-7.25) B(2.54,-7.25) C(0,-7.25) D(-2.54,7.25) E(2.54,7.25)

## Nets
As in the schematic.

Pads without a net: SW1 6 7; U1 1 2 4 5 11 12 16 17 30 35 37 39 40 41 42 43

## Via types
v1: diameter 0.61, hole 0.305, Top Layer to Bottom Layer, 32 vias

## Routing (per net, layer and track width the routed paths; a pad name or vN(x,y) marks a point on that pad's centre or on a via; arc(x,y) is an arc through that point)
GND:
  vias: v1(34.42,65.28) v1(41.91,29.34) v1(54.1,65.28) v1(66.04,39.5) v1(72.52,65.28) v1(73.02,54.86) v1(77.47,39.62) v1(85.98,39.37) v1(90.55,65.15) v1(101.6,35.05) v1(104.14,65.28) v1(117.86,85.85) v1(125.98,90.68) v1(130.43,42.93) v1(133.86,48.77) v1(135.89,64.57) v1(142.37,56.9) v1(156.08,59.18) v1(161.29,68.33)
VCC: length 199.4
  Top Layer w0.254: v1(159.77,57.91) v1(159.77,60.07)
  Bottom Layer w0.254: v1(159.77,60.07) 159.77,76.58 U1.36 U1.36 ; v1(29.41,11.57) 29.41,18.36 33.02,21.97 63.88,21.97 64.73,21.12 142.15,21.12 159.77,38.73 v1(159.77,57.91)
A: length 19.6
  Top Layer w0.254: U1.15 162.43,56.39 162.43,45.73 SW1.A
B: length 24.3
  Top Layer w0.254: U1.14 157.23,53.72 157.23,45.6 SW1.B
COL0: length 105.3
  Top Layer w0.254: KEY1.1 134.75,77.03 KEY8.1 129.98,55.59 127.6,53.21 127.6,38.93 KEY22.1 122.84,24.64 KEY28.1
  Bottom Layer w0.254: KEY1.1 134.75,88.9 141.99,81.66 U1.34
COL1: length 133
  Top Layer w0.254: KEY29.1 91.88,31.78 KEY23.1 101.41,43.69 KEY16.1 106.17,57.98 KEY9.1 115.7,81.79 115.7,91.31
  Bottom Layer w0.254: 115.7,91.31 126.75,91.31 141.48,76.58 U1.32
COL2: length 154.9
  Top Layer w0.254: KEY30.1 72.83,27.02 KEY24.1 82.36,43.69 KEY17.1 87.12,57.98 KEY10.1 96.65,81.79 KEY3.1
  Bottom Layer w0.254: U1.29 147.07,68.96 129.56,86.47 98.57,86.47 96.65,88.39 KEY3.1
COL3: length 179.7
  Top Layer w0.254: KEY4.1 77.6,81.79 KEY11.1 68.07,57.98 KEY18.1 63.31,43.69 KEY25.1 53.78,22.26 KEY31.1
  Bottom Layer w0.254: KEY18.1 73.98,63.88 U1.27
COL4: length 192.1
  Top Layer w0.254: KEY26.1 44.26,43.69 KEY19.1 49.02,57.98 KEY12.1 58.55,81.79 KEY5.1
  Bottom Layer w0.254: KEY26.1 41.4,34.16 50.67,43.43 127.63,43.43 135.32,51.11 135.32,51.16 142.96,58.8 U1.25
COL5: length 215.6
  Top Layer w0.254: KEY6.1 39.5,81.79 KEY13.1 29.97,57.98 KEY20.1 25.21,43.69 KEY27.1
  Bottom Layer w0.254: U1.24 144.91,56.26 129.41,40.77 50.94,40.77 39.5,29.32 18.54,29.32 18.52,29.34 18.03,29.34 15.68,31.69 KEY27.1
COL6: length 243
  Top Layer w0.254: KEY7.1 20.45,81.79 KEY14.1 10.92,57.98 KEY21.1
  Bottom Layer w0.254: 165.85,52.71 165.85,43.17 155.83,33.15 155.83,29.83 ; 165.85,52.71 153.42,65.15 122.94,65.15 122.3,64.52 17.46,64.52 KEY21.1 ; 165.85,52.71 U1.19
ROW0: length 139.5
  Top Layer w0.254: v1(134.11,82.9) 131.83,85.19 D1.1
  Bottom Layer w0.254: v1(134.11,82.9) 142.97,74.04 U1.31 U1.31 ; D1.1 D2.1 D3.1 D4.1 D5.1 D6.1 D7.1
ROW1: length 146.4
  Top Layer w0.254: D8.1 v1(125.22,63.09)
  Bottom Layer w0.254: D14.1 D13.1 D12.1 D11.1 D10.1 D9.1 D8.1 ; U1.26 U1.26 148.48,61.56 126.75,61.56 v1(125.22,63.09)
ROW2: length 131.9
  Top Layer w0.254: v1(140.72,51.15) 136.52,46.96 v1(129.67,46.96)
  Bottom Layer w0.254: v1(129.67,46.96) 119.25,46.96 D15.1 D16.1 D17.1 D18.1 D19.1 D20.1 D21.1 ; v1(140.72,51.15) 140.75,51.18 U1.22 U1.22
ROW3: length 152.9
  Bottom Layer w0.254: D27.1 D26.1 D24.1 D23.1 D22.1 116.84,36.16 127.51,36.16 128.52,35.15 130.05,35.15 143.54,48.64 U1.21 U1.21
ROW4: length 183.7
  Top Layer w0.254: U1.20 167.39,47.75 ; 167.39,47.75 167.39,31.37 145,8.98 D28.1 ; 167.39,47.75 161.67,42.04 155.32,42.04 151.35,46.01 148.84,46.01
  Bottom Layer w0.254: D28.1 D29.1 D30.1 D31.1
SCL0: length 184.7
  Top Layer w0.254: CN1.3 35.5,6.17 36.7,7.37 53.85,7.37 69.6,23.11 69.6,33.29 79.05,42.74 v1(80.57,42.74) ; U1.7 150.88,65.15 148.34,65.15 144.58,61.4 v1(144.58,57.98)
  Bottom Layer w0.254: v1(144.58,57.98) 137.7,51.1 137.7,50.19 137.01,49.5 136.1,49.5 129.34,42.74 v1(80.57,42.74)
SCL1: length 2.4
  Bottom Layer w0.254: v1(166.37,72.89) 167.13,72.89 U1.10
SDA0: length 177
  Top Layer w0.254: v1(61.14,48.01) 61.14,45.78 34.5,19.13 32.09,19.13 23.12,10.17 CN1.4 ; v1(142.04,60.97) 148.9,67.82 151.01,67.82 U1.6
  Bottom Layer w0.254: v1(142.04,60.97) 87.43,60.97 80.57,54.11 67.3,54.11 61.2,48.01 v1(61.14,48.01)
SDA1: length 2.4
  Bottom Layer w0.254: U1.9 167.13,75.43 v1(166.37,75.43)
$1N158: length 12.1
  Bottom Layer w0.254: KEY1.2 141.06,93.88 D1.2
$1N243: length 12.1
  Bottom Layer w0.254: D2.2 122.01,93.88 KEY2.2
$1N305: length 12.1
  Bottom Layer w0.254: KEY3.2 102.97,93.88 D3.2
$1N549: length 12.1
  Bottom Layer w0.254: KEY4.2 83.91,93.88 D4.2
$1N551: length 12.1
  Bottom Layer w0.254: D5.2 64.87,93.88 KEY5.2
$1N553: length 12.1
  Bottom Layer w0.254: D6.2 45.81,93.88 KEY6.2
$1N987: length 12.1
  Bottom Layer w0.254: KEY7.2 26.76,93.88 D7.2
$1N1409: length 14.2
  Bottom Layer w0.254: KEY8.2 136.3,74.83 D8.2
$1N1411: length 12.1
  Bottom Layer w0.254: D9.2 112.49,74.83 KEY9.2
$1N1413: length 12.1
  Bottom Layer w0.254: KEY10.2 93.44,74.83 D10.2
$1N1415: length 12.1
  Bottom Layer w0.254: D11.2 74.39,74.83 KEY11.2
$1N1417: length 12.1
  Bottom Layer w0.254: D12.2 55.34,74.83 KEY12.2
$1N1419: length 12.1
  Bottom Layer w0.254: D13.2 24.29,74.8 KEY13.2
$1N1421: length 12.1
  Bottom Layer w0.254: D14.2 5.24,74.8 KEY14.2
$1N1843: length 14.8
  Bottom Layer w0.254: D15.2 133.92,55.78 133.95,55.75
$1N1845: length 7
  Bottom Layer w0.254: D16.2 114.73,55.75 KEY16.2
$1N1847: length 7
  Bottom Layer w0.254: KEY17.2 95.68,55.75 D17.2
$1N1849: length 7
  Bottom Layer w0.254: D18.2 76.63,55.75 KEY18.2
$1N1851: length 7
  Bottom Layer w0.254: KEY19.2 57.58,55.75 D19.2
$1N1853: length 7
  Bottom Layer w0.254: KEY20.2 38.53,55.75 D20.2
$1N1855: length 7
  Bottom Layer w0.254: D21.2 19.48,55.75 KEY21.2
$1N2217: length 20.5
  Bottom Layer w0.254: D22.2 129.16,36.73 KEY22.2
$1N2219: length 12.1
  Bottom Layer w0.254: D23.2 98.2,36.73 KEY23.2
$1N2221: length 12.1
  Bottom Layer w0.254: KEY24.2 67.09,36.7 D24.2
$1N2223: length 11.1
  Bottom Layer w0.254: D25.2 60.1,36.73 KEY25.2
$1N2225: length 12.1
  Bottom Layer w0.254: KEY26.2 41.05,36.73 D26.2
$1N2227: length 16
  Bottom Layer w0.254: D27.2 22,36.73 KEY27.2
$1N2529: length 14.8
  Bottom Layer w0.254: KEY28.2 138.68,17.69 D28.2
$1N2531: length 14.6
  Bottom Layer w0.254: D29.2 114.87,17.69 KEY29.2
$1N4626: length 14.4
  Bottom Layer w0.254: D30.2 91.06,17.69 KEY30.2
$1N4628: length 20.2
  Bottom Layer w0.254: D31.2 37.73,17.69 37.74,17.68 39.3,17.68 39.3,17.69 52.96,17.69 52.99,17.65
$1N26639: length 20.4
  Top Layer w0.254: D32.2 148.84,32 153.54,27.3 158.38,27.3 160.91,29.83

## Copper pours and planes (outline as drawn; the poured copper is in the pictures)
GND on Top Layer: -15.11,111.12 188.98,111.12 188.98,-19.81 -15.11,-19.81
GND on Bottom Layer: -14.73,110.87 188.59,110.87 188.59,-19.81 -14.73,-19.81

# Board PCB1
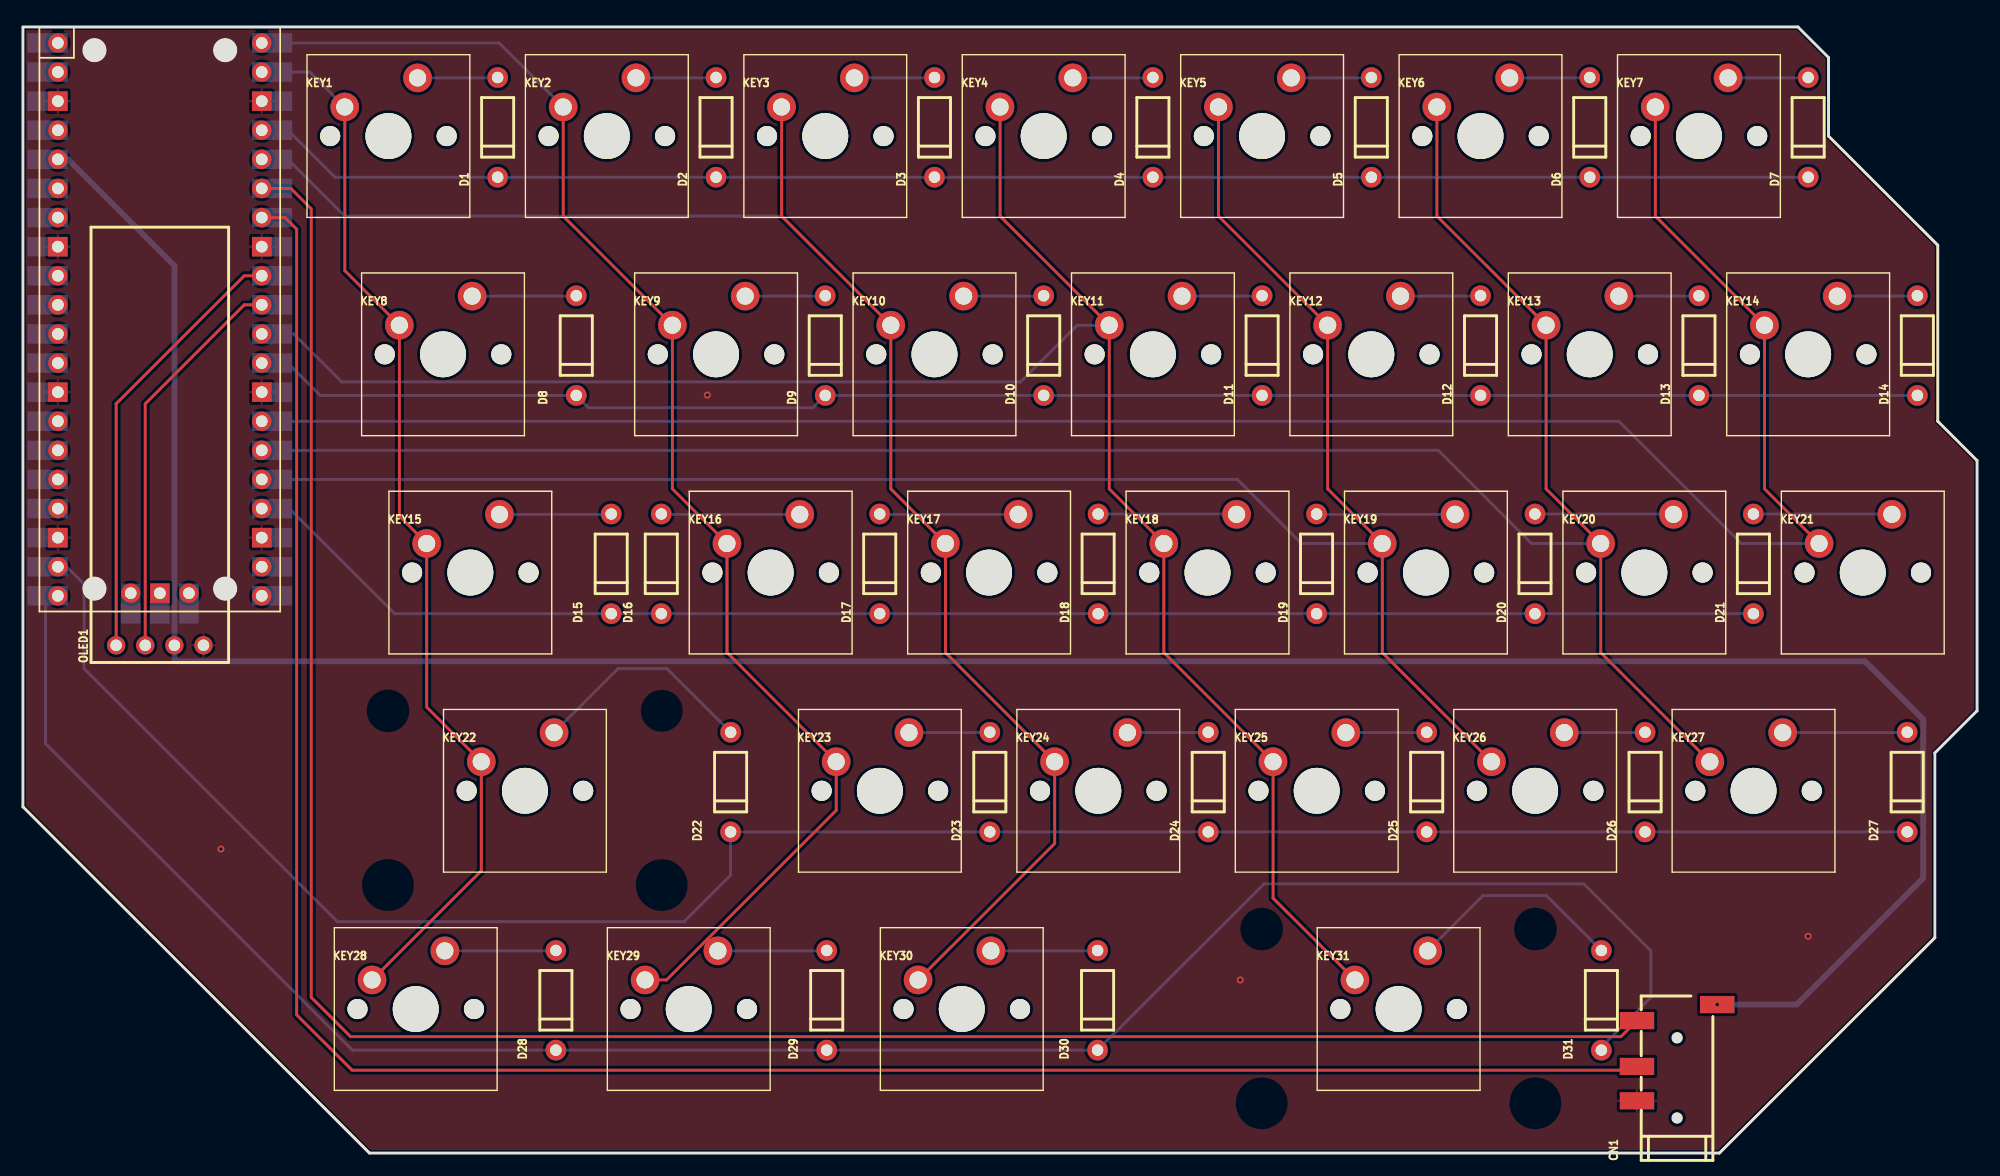
[diagram p4: board, top side]
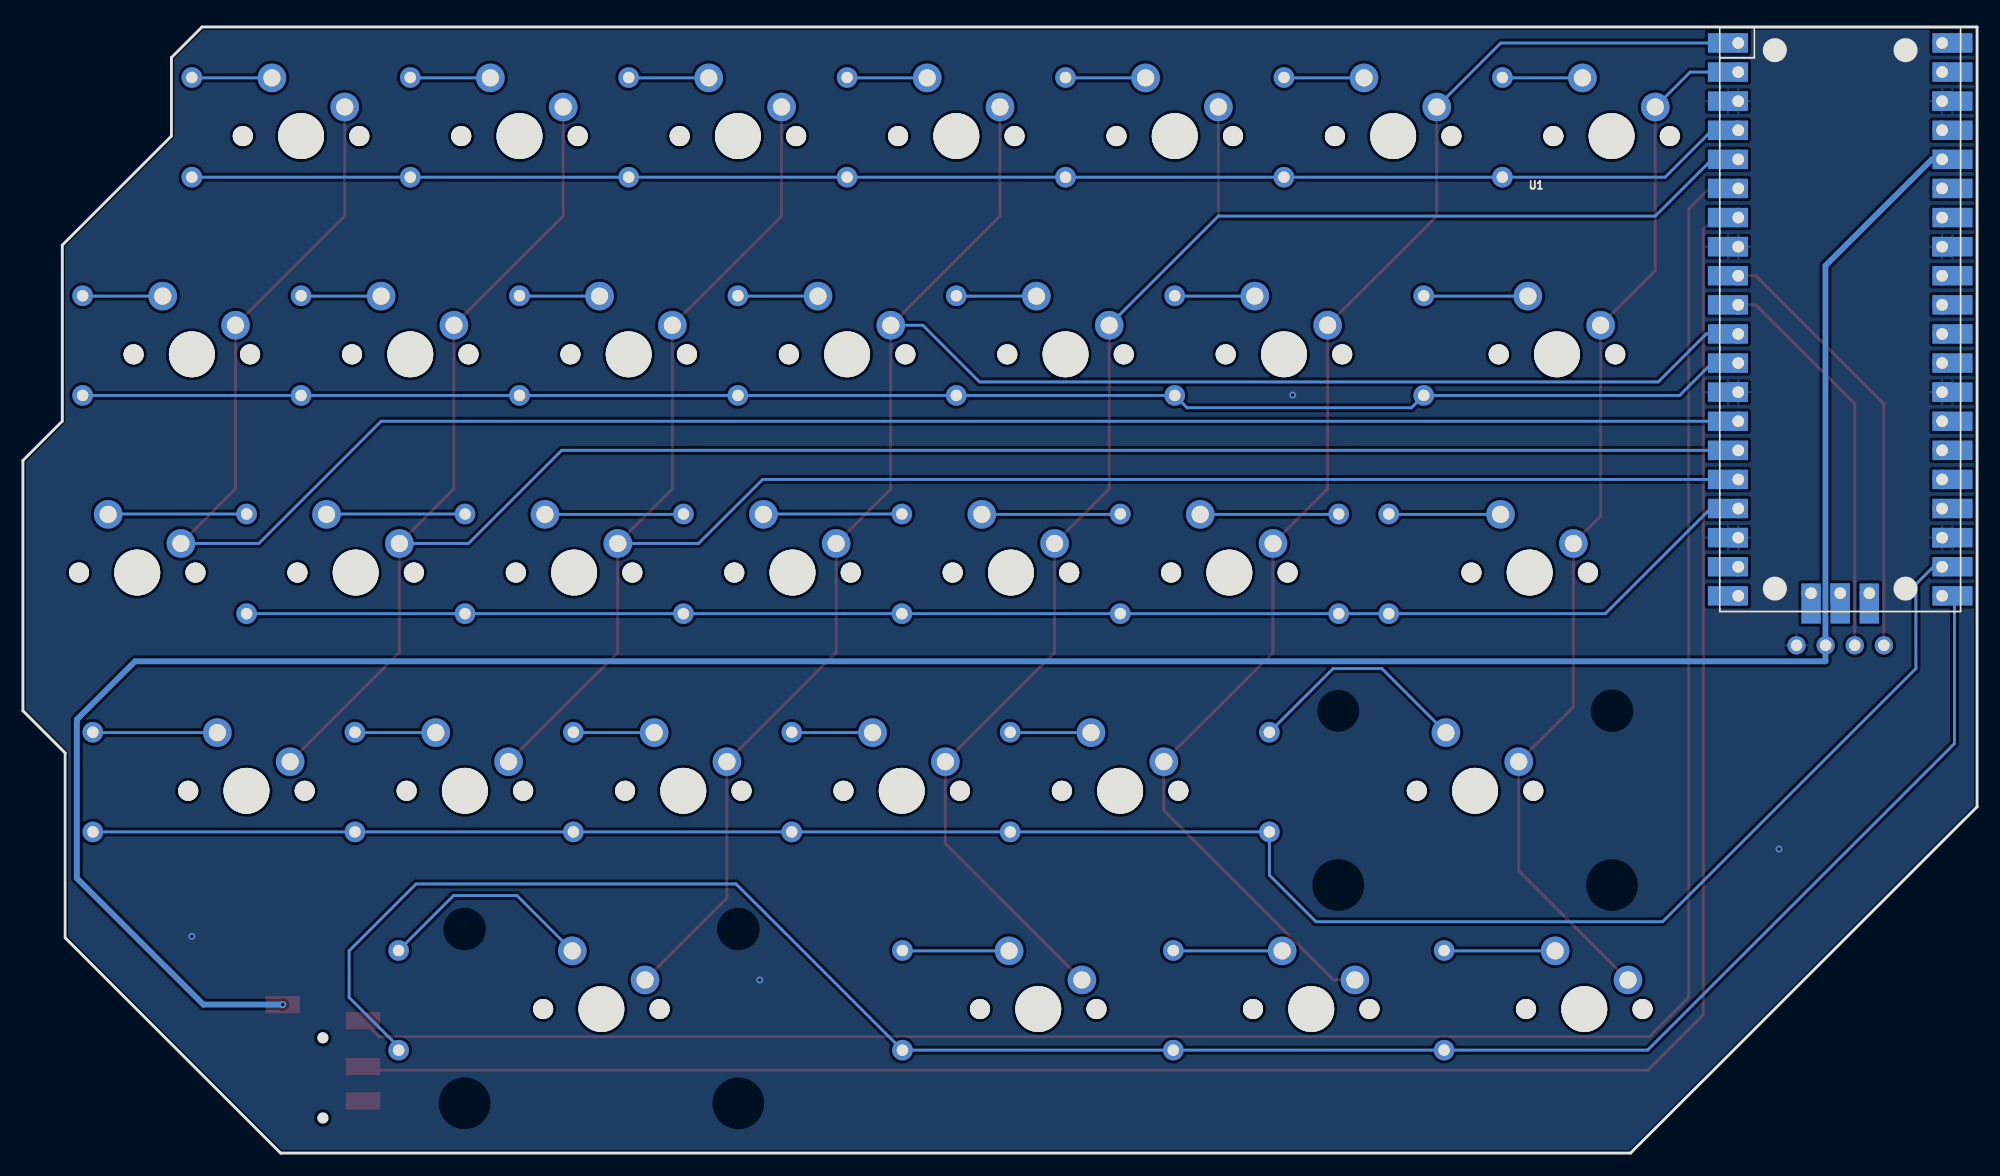
[diagram p5: board, bottom side, seen from below]

Outline 170.43 x 98.3 mm; copper layers: Top Layer, Bottom Layer. Coordinates in mm from the lower left corner of the outline.
Outline path: 0,98.3 154.81,98.3 157.48,95.63 157.48,88.77 167,79.25 167,63.88 170.43,60.45 170.43,38.61 166.75,34.92 166.75,18.8 147.95,0 30.23,0 0,30.23 0,98.3
Stack: Top Layer 0.035mm / Dielectric1 1.51mm FR4 er 4.5 / Bottom Layer 0.035mm

## Design rules (mm)
template: JLCPCB Capability(Two Layers Board)
spacing copperThickness1oz (default): track to track 0.102, other pairs 0.152 to 0.3
spacing copperThickness2oz: track to track 0.203, other pairs 0.152 to 0.3
track width copperThickness1oz (default): min 0.127, default 0.254, max 2.54
track width copperThickness2oz: min 0.203, default 0.254, max 2.54
differential pair differentialPair (default): width min 0.127, default 0.254, max 2.54; gap min 0.152, default 0.152
via viaSize (default): diameter min 0.5, default 0.61, max 10; hole min 0.3, default 0.305, max 6.3

## Placement (name value [footprint] x y rotation side)
CN1  PJ-320D  [AUDIO-SMD_PJ-320D-1]  144.27 8.76 90 top
D1  -  [DO-41_BD2.4-L4.7-P8.70-D0.9-RD]  41.4 89.53 90 top
D2  -  [DO-41_BD2.4-L4.7-P8.70-D0.9-RD]  60.45 89.53 90 top
D3  -  [DO-41_BD2.4-L4.7-P8.70-D0.9-RD]  79.5 89.53 90 top
D4  -  [DO-41_BD2.4-L4.7-P8.70-D0.9-RD]  98.55 89.53 90 top
D5  -  [DO-41_BD2.4-L4.7-P8.70-D0.9-RD]  117.6 89.53 90 top
D6  -  [DO-41_BD2.4-L4.7-P8.70-D0.9-RD]  136.65 89.53 90 top
D7  -  [DO-41_BD2.4-L4.7-P8.70-D0.9-RD]  155.7 89.53 90 top
D8  -  [DO-41_BD2.4-L4.7-P8.70-D0.9-RD]  48.26 70.48 90 top
D9  -  [DO-41_BD2.4-L4.7-P8.70-D0.9-RD]  69.98 70.48 90 top
D10  -  [DO-41_BD2.4-L4.7-P8.70-D0.9-RD]  89.03 70.48 90 top
D11  -  [DO-41_BD2.4-L4.7-P8.70-D0.9-RD]  108.08 70.48 90 top
D12  -  [DO-41_BD2.4-L4.7-P8.70-D0.9-RD]  127.13 70.48 90 top
D13  -  [DO-41_BD2.4-L4.7-P8.70-D0.9-RD]  146.18 70.48 90 top
D14  -  [DO-41_BD2.4-L4.7-P8.70-D0.9-RD]  165.23 70.48 90 top
D15  -  [DO-41_BD2.4-L4.7-P8.70-D0.9-RD]  51.31 51.44 90 top
D16  -  [DO-41_BD2.4-L4.7-P8.70-D0.9-RD]  55.68 51.44 90 top
D17  -  [DO-41_BD2.4-L4.7-P8.70-D0.9-RD]  74.73 51.44 90 top
D18  -  [DO-41_BD2.4-L4.7-P8.70-D0.9-RD]  93.78 51.44 90 top
D19  -  [DO-41_BD2.4-L4.7-P8.70-D0.9-RD]  112.83 51.44 90 top
D20  -  [DO-41_BD2.4-L4.7-P8.70-D0.9-RD]  131.88 51.44 90 top
D21  -  [DO-41_BD2.4-L4.7-P8.70-D0.9-RD]  150.93 51.44 90 top
D22  -  [DO-41_BD2.4-L4.7-P8.70-D0.9-RD]  61.72 32.39 90 top
D23  -  [DO-41_BD2.4-L4.7-P8.70-D0.9-RD]  84.33 32.39 90 top
D24  -  [DO-41_BD2.4-L4.7-P8.70-D0.9-RD]  103.38 32.39 90 top
D25  -  [DO-41_BD2.4-L4.7-P8.70-D0.9-RD]  122.43 32.39 90 top
D26  -  [DO-41_BD2.4-L4.7-P8.70-D0.9-RD]  141.48 32.39 90 top
D27  -  [DO-41_BD2.4-L4.7-P8.70-D0.9-RD]  164.34 32.39 90 top
D28  -  [DO-41_BD2.4-L4.7-P8.70-D0.9-RD]  46.48 13.34 90 top
D29  -  [DO-41_BD2.4-L4.7-P8.70-D0.9-RD]  70.1 13.34 90 top
D30  -  [DO-41_BD2.4-L4.7-P8.70-D0.9-RD]  93.73 13.34 90 top
D31  -  [DO-41_BD2.4-L4.7-P8.70-D0.9-RD]  137.67 13.34 90 top
KEY1  28115182DM  [MX_PCB_1.00u]  31.88 88.77 0 top
KEY2  28115182DM  [MX_PCB_1.00u]  50.93 88.77 0 top
KEY3  28115182DM  [MX_PCB_1.00u]  69.98 88.77 0 top
KEY4  28115182DM  [MX_PCB_1.00u]  89.03 88.77 0 top
KEY5  28115182DM  [MX_PCB_1.00u]  108.08 88.77 0 top
KEY6  28115182DM  [MX_PCB_1.00u]  127.13 88.77 0 top
KEY7  28115182DM  [MX_PCB_1.00u]  146.18 88.77 0 top
KEY8  28115182DM  [MX_PCB_1.00u]  36.64 69.72 0 top
KEY9  28115182DM  [MX_PCB_1.00u]  60.45 69.72 0 top
KEY10  28115182DM  [MX_PCB_1.00u]  79.5 69.72 0 top
KEY11  28115182DM  [MX_PCB_1.00u]  98.55 69.72 0 top
KEY12  28115182DM  [MX_PCB_1.00u]  117.6 69.72 0 top
KEY13  28115182DM  [MX_PCB_1.00u]  136.65 69.72 0 top
KEY14  28115182DM  [MX_PCB_1.00u]  155.7 69.72 0 top
KEY15  28115182DM  [MX_PCB_1.00u]  39.02 50.67 0 top
KEY16  28115182DM  [MX_PCB_1.00u]  65.21 50.67 0 top
KEY17  28115182DM  [MX_PCB_1.00u]  84.26 50.67 0 top
KEY18  28115182DM  [MX_PCB_1.00u]  103.31 50.67 0 top
KEY19  28115182DM  [MX_PCB_1.00u]  122.36 50.67 0 top
KEY20  28115182DM  [MX_PCB_1.00u]  141.41 50.67 0 top
KEY21  28115182DM  [MX_PCB_1.00u]  160.46 50.67 0 top
KEY22  28115182DM  [MX_PCB_1.00u]  43.78 31.62 0 top
KEY23  28115182DM  [MX_PCB_1.00u]  74.74 31.62 0 top
KEY24  28115182DM  [MX_PCB_1.00u]  93.79 31.62 0 top
KEY25  28115182DM  [MX_PCB_1.00u]  112.84 31.62 0 top
KEY26  28115182DM  [MX_PCB_1.00u]  131.89 31.62 0 top
KEY27  28115182DM  [MX_PCB_1.00u]  150.94 31.62 0 top
KEY28  28115182DM  [MX_PCB_1.00u]  34.26 12.57 0 top
KEY29  28115182DM  [MX_PCB_1.00u]  58.07 12.57 0 top
KEY30  28115182DM  [MX_PCB_1.00u]  81.88 12.57 0 top
KEY31  28115182DM  [MX_PCB_1.00u]  119.98 12.57 0 top
OLED1  HS91L02W2C01  [OLED-TH_L38.0-W12.0_HS91L02W2C01]  11.94 44.32 90 top
U1  PICO  [Raspberry_Pi_Pico]  11.94 72.77 180 bottom

## Footprints (pads in the part's own frame, mm; a bottom-side part is the same pattern mirrored in y, then rotated)
AUDIO-SMD_PJ-320D-1
  rect 1.5x3 smd: 1(4.2,-3.5) 2(-4.2,3.5) 3(-1.2,3.5) 4(2.8,3.5)
DO-41_BD2.4-L4.7-P8.70-D0.9-RD
  round 1.8 hole 1: 1(-4.35,0) 2(4.35,0)
MX_PCB_1.00u
  round 1.75 hole 1.75: (-5.08,0) (5.08,0)
  round 4 hole 4: (0,0)
  round 2.5 hole 1.5: 1(-3.81,2.54) 2(2.54,5.08)
OLED-TH_L38.0-W12.0_HS91L02W2C01
  round 1.6 hole 1: 1(0,-3.81) 2(0,-1.27) 3(0,1.27) 4(0,3.81)
Raspberry_Pi_Pico
  rect 3.5x1.7 smd: 1(-9.79,24.13) 2(-9.79,21.59) 3(-9.79,19.05) 4(-9.79,16.51) 5(-9.79,13.97) 6(-9.79,11.43) 7(-9.79,8.89) 8(-9.79,6.35) 9(-9.79,3.81) 10(-9.79,1.27) 11(-9.79,-1.27) 12(-9.79,-3.81) 13(-9.79,-6.35) 14(-9.79,-8.89) 15(-9.79,-11.43) 16(-9.79,-13.97) 17(-9.79,-16.51) 18(-9.79,-19.05) 19(-9.79,-21.59) 20(-9.79,-24.13) 21(9.79,-24.13) 22(9.79,-21.59) 23(9.79,-19.05) 24(9.79,-16.51) 25(9.79,-13.97) 26(9.79,-11.43) 27(9.79,-8.89) 28(9.79,-6.35) 29(9.79,-3.81) 30(9.79,-1.27) 31(9.79,1.27) 32(9.79,3.81) 33(9.79,6.35) 34(9.79,8.89) 35(9.79,11.43) 36(9.79,13.97) 37(9.79,16.51) 38(9.79,19.05) 39(9.79,21.59) 40(9.79,24.13)
  round 1.7 hole 1.02: 1(-8.89,24.13) 2(-8.89,21.59) 4(-8.89,16.51) 5(-8.89,13.97) 6(-8.89,11.43) 7(-8.89,8.89) 9(-8.89,3.81) 10(-8.89,1.27) 11(-8.89,-1.27) 12(-8.89,-3.81) 14(-8.89,-8.89) 15(-8.89,-11.43) 16(-8.89,-13.97) 17(-8.89,-16.51) 19(-8.89,-21.59) 20(-8.89,-24.13) 21(8.89,-24.13) 22(8.89,-21.59) 24(8.89,-16.51) 25(8.89,-13.97) 26(8.89,-11.43) 27(8.89,-8.89) 29(8.89,-3.81) 30(8.89,-1.27) 31(8.89,1.27) 32(8.89,3.81) 34(8.89,8.89) 35(8.89,11.43) 36(8.89,13.97) 37(8.89,16.51) 39(8.89,21.59) 40(8.89,24.13) 41(-2.54,-23.9) 43(2.54,-23.9)
  rect 1.7x1.7 hole 1.02: 3(-8.89,19.05) 8(-8.89,6.35) 13(-8.89,-6.35) 18(-8.89,-19.05) 23(8.89,-19.05) 28(8.89,-6.35) 33(8.89,6.35) 38(8.89,19.05) 42(0,-23.9)
  rect 1.7x3.5 smd: 41(-2.54,-24.8) 42(0,-24.8) 43(2.54,-24.8)

## Nets
As in the schematic.

Pads without a net: U1 19 20 24 25 26 27 29 30 31 32 34 35 37 39 40 41 42 43

## Via types
v1: diameter 0.61, hole 0.305, Top Layer to Bottom Layer, 5 vias

## Routing (per net, layer and track width the routed paths; a pad name or vN(x,y) marks a point on that pad's centre or on a via; arc(x,y) is an arc through that point)
GND:
  vias: v1(17.27,26.54) v1(59.69,66.17) v1(106.17,15.11) v1(155.7,18.92)
VCC: length 240.6
  Bottom Layer w0.508: v1(147.77,12.96) 154.69,12.96 165.73,24 165.73,37.85 160.66,42.93 13.22,42.93 13.22,77.46 3.94,86.74 1.97,86.74
COL0: length 93.3
  Top Layer w0.254: 28.07,91.31 28.07,77.03 32.83,72.26 32.83,55.59 35.22,53.21 35.22,38.93 39.98,34.16 39.98,24.64 30.45,15.11
  Bottom Layer w0.254: 28.07,91.31 25.03,94.36 21.14,94.36
COL1: length 122.4
  Top Layer w0.254: 54.27,15.11 56.13,15.11 70.93,29.91 70.93,34.16 61.41,43.69 61.41,53.21 56.65,57.98 56.65,72.26 47.12,81.79 47.12,91.31
  Bottom Layer w0.254: 47.12,91.31 41.54,96.9 21.14,96.9
COL2: length 151.5
  Top Layer w0.254: 78.08,15.11 89.98,27.02 89.98,34.16 80.46,43.69 80.46,53.21 75.7,57.98 75.7,72.26 66.17,81.79 66.17,91.31
  Bottom Layer w0.254: 75.7,72.26 66.17,81.79 28.07,81.79 23.12,86.74 21.14,86.74
COL3: length 166.4
  Top Layer w0.254: 85.22,91.31 85.22,81.79 94.75,72.26 94.75,57.98 99.51,53.21 99.51,43.69 109.03,34.16 109.03,22.26 116.18,15.11
  Bottom Layer w0.254: 21.14,71.5 23.62,71.5 27.81,67.31 87,67.31 91.95,72.26 94.75,72.26
COL4: length 166.7
  Top Layer w0.254: 104.27,91.31 104.27,81.79 113.8,72.26 113.8,57.98 118.56,53.21 118.56,43.69 128.08,34.16
  Bottom Layer w0.254: 118.56,53.21 111.51,53.21 105.92,58.8 21.15,58.8 21.14,58.8
COL5: length 186.8
  Top Layer w0.254: 123.32,91.31 123.32,81.79 132.85,72.26 132.85,57.98 137.61,53.21 137.61,43.69 147.13,34.16
  Bottom Layer w0.254: 21.14,61.34 21.15,61.34 123.44,61.34 131.57,53.21 137.61,53.21
COL6: length 184
  Top Layer w0.254: 156.66,53.21 151.9,57.98 151.9,72.26 142.37,81.79 142.37,91.31
  Bottom Layer w0.254: 21.14,63.88 21.15,63.88 139.19,63.88 149.86,53.21 156.66,53.21
ROW0: length 136.3
  Bottom Layer w0.254: 21.14,89.28 21.4,89.03 23.37,89.03 27.21,85.19 D1.1 D2.1 D3.1 D4.1 D5.1 D6.1 D7.1
ROW1: length 146.1
  Bottom Layer w0.254: D14.1 D13.1 D12.1 D11.1 D10.1 D9.1 68.9,65.06 49.34,65.06 D8.1 25.94,66.14 23.12,68.96 21.14,68.96
ROW2: length 133.6
  Bottom Layer w0.254: 21.14,56.26 21.15,56.26 23.24,56.26 32.42,47.08 D15.1 D16.1 D17.1 D18.1 D19.1 D20.1 D21.1
ROW3: length 185
  Bottom Layer w0.254: 1.97,51.18 3.81,51.18 5.33,49.66 5.33,42.29 27.43,20.19 57.66,20.19 61.72,24.26 D22.1 D23.1 D24.1 D25.1 D26.1 D27.1
ROW4: length 182.9
  Bottom Layer w0.254: D31.1 137.67,9.27 141.99,13.59 141.99,17.65 136.14,23.5 108.24,23.5 D30.1 D29.1 D28.1 28.73,8.98 1.97,35.75 1.97,48.64
SCL0: length 190.8
  Top Layer w0.254: 21.14,81.66 22.86,81.66 23.88,80.64 23.88,12.06 28.7,7.24 140.45,7.24 CN1.3
SCL1: length 35.1
  Top Layer w0.254: OLED1.3 10.67,65.41 19.3,74.04 21.14,74.04
SDA0: length 191.2
  Top Layer w0.254: CN1.4 139.37,10.16 28.57,10.16 25.15,13.59 25.15,82.42 23.37,84.2 21.14,84.2
SDA1: length 38.7
  Top Layer w0.254: OLED1.4 8.13,65.41 19.3,76.58 21.14,76.58 21.14,76.58
$1N158: length 7
  Bottom Layer w0.254: D1.2 41.37,93.85 34.41,93.85
$1N243: length 7
  Bottom Layer w0.254: D2.2 60.42,93.85 53.46,93.85
$1N305: length 7
  Bottom Layer w0.254: D3.2 79.47,93.85 72.51,93.85
$1N549: length 7
  Bottom Layer w0.254: 91.56,93.85 98.52,93.85 D4.2
$1N551: length 7
  Bottom Layer w0.254: 110.61,93.85 117.57,93.85 D5.2
$1N553: length 7
  Bottom Layer w0.254: 129.66,93.85 136.62,93.85 D6.2
$1N987: length 7
  Bottom Layer w0.254: D7.2 155.67,93.85 148.71,93.85
$1N1409: length 9.1
  Bottom Layer w0.254: 39.17,74.8 48.23,74.8 D8.2
$1N1411: length 7
  Bottom Layer w0.254: 62.99,74.8 69.94,74.8 D9.2
$1N1413: length 7
  Bottom Layer w0.254: 82.04,74.8 88.99,74.8 D10.2
$1N1415: length 7
  Bottom Layer w0.254: 101.09,74.8 108.04,74.8 D11.2
$1N1417: length 7
  Bottom Layer w0.254: D12.2 127.09,74.8 120.14,74.8
$1N1419: length 7
  Bottom Layer w0.254: 139.19,74.8 146.14,74.8 D13.2
$1N1421: length 7
  Bottom Layer w0.254: 158.24,74.8 165.19,74.8 D14.2
$1N1843: length 9.8
  Bottom Layer w0.254: D15.2 51.28,55.75 41.56,55.75
$1N1845: length 12.1
  Bottom Layer w0.254: D16.2 55.71,55.75 67.75,55.75
$1N1847: length 12.1
  Bottom Layer w0.254: D17.2 74.76,55.75 86.8,55.75
$1N1849: length 12.1
  Bottom Layer w0.254: D18.2 105.82,55.78 105.85,55.75
$1N1851: length 12.1
  Bottom Layer w0.254: 124.9,55.75 112.86,55.75 D19.2
$1N1853: length 12.1
  Bottom Layer w0.254: 143.95,55.75 143.92,55.78 D20.2
$1N1855: length 12.1
  Bottom Layer w0.254: D21.2 162.97,55.78 163,55.75
$1N2217: length 20
  Bottom Layer w0.254: 46.32,36.7 51.91,42.29 56.17,42.29 D22.2
$1N2219: length 7.1
  Bottom Layer w0.254: 77.27,36.7 84.3,36.7 D23.2
$1N2221: length 7.1
  Bottom Layer w0.254: D24.2 103.35,36.7 96.32,36.7
$1N2223: length 7.1
  Bottom Layer w0.254: D25.2 122.4,36.7 115.37,36.7
$1N2225: length 7.1
  Bottom Layer w0.254: 134.42,36.7 141.45,36.7 D26.2
$1N2227: length 10.9
  Bottom Layer w0.254: 153.47,36.7 164.31,36.7 D27.2
$1N2529: length 9.7
  Bottom Layer w0.254: 36.79,17.65 46.45,17.65 D28.2
$1N2531: length 9.5
  Bottom Layer w0.254: D29.2 70.07,17.65 60.61,17.65
$1N4626: length 9.3
  Bottom Layer w0.254: D30.2 93.69,17.65 84.42,17.65
$1N4628: length 19.1
  Bottom Layer w0.254: 122.52,17.65 127.34,22.48 132.87,22.48 D31.2

## Copper pours and planes (outline as drawn; the poured copper is in the pictures)
GND on Top Layer: -1.78,100.2 176.02,100.2 176.02,-5.21 -1.78,-5.21
GND on Bottom Layer: -1.78,100.2 176.02,100.2 176.02,-5.21 -1.78,-5.21
